# Altium project jetson-nano-baseboard.PrjPcb (part 1 of 2)
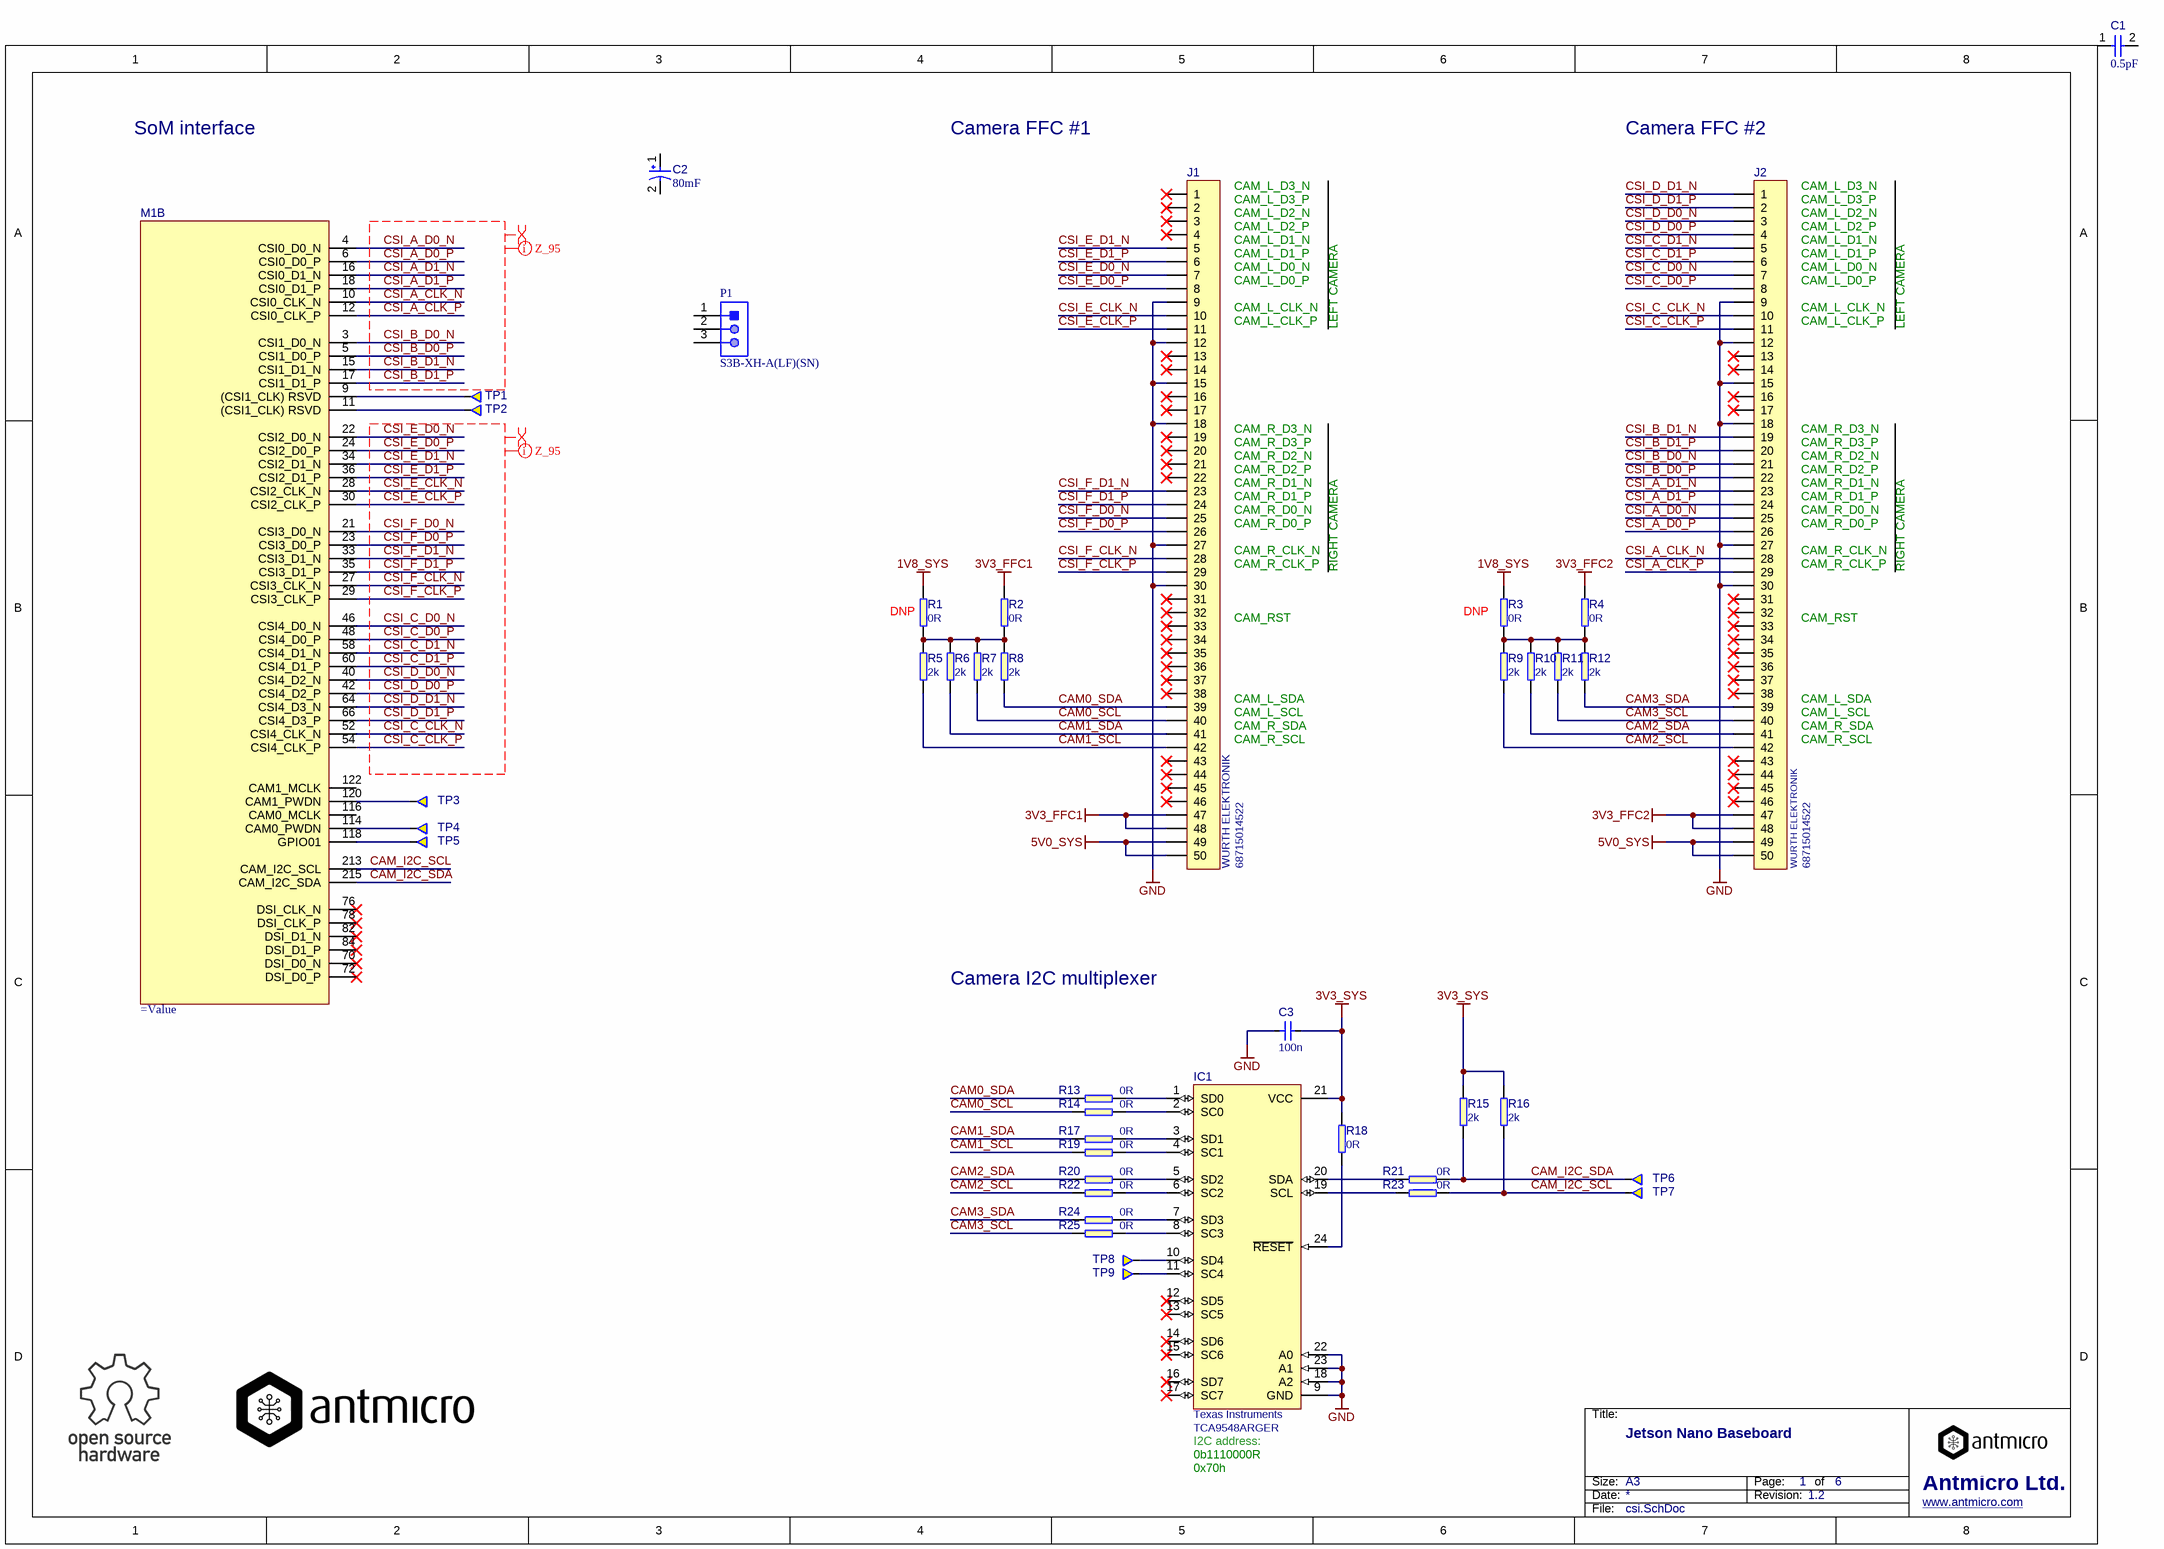
[diagram p0: csi.SchDoc]
AM_Revision: 1.2; AM_Status: Prototype; AM_Title: Jetson Nano Baseboard
6 sheets, 290 parts. Net scope: global (net labels, ports and power ports of the same name join across sheets).
Board file: PCB.PcbDoc
Sheets:
  csi.SchDoc
  display.SchDoc
  ethernet.SchDoc
  SoM.SchDoc
  supply.SchDoc
  usb-debug.SchDoc

## Sheet csi.SchDoc
size A3; DocumentNumber: 1; SheetNumber: 1; SheetTotal: 6; PageSetup: Record=PageOptions|CenterHorizontal=True|CenterVertical=True|PrintScale=0.97|XCorrection=1.00|YCorrection=1.00|PrintKind=1|BorderSize=5000000|LeftOffset=0|BottomOffset=0|Orientation=2|PaperLength=2970|PaperWidth=2100|Scale=100|PaperSource=7|PrintQuality=600|MediaType=1|DitherType=10|PaperKind=A4|PrintScaleMode=1

### Parts
C1  value 0.5pF  [CAPC1005X56X25ML10T15]  (hidden comment: Capacitor 0.5 pF +/- 0.1pF 25 V 0402)
C2  value 80mF  [SEIK-XH414HG-IV01E_V]  (hidden comment: XH414HG-IV01E)
C3  100n  [0402]
IC1  TCA9548ARGER  Manufacturer: Texas Instruments  [VQFN-24]
J1  68715014522  Manufacturer: WURTH ELEKTRONIK  [68715014522]
J2  68715014522  Manufacturer: WURTH ELEKTRONIK  [68715014522]
M1  (no value)  [jetson-nano-connector]  (part B of 7)
P1  S3B-XH-A(LF)(SN)  [JST-S3B-XH-A(LF)(SN)_V]
R1  0R  [0402]
R2  0R  [0402]
R3  0R  [0402]
R4  0R  [0402]
R5  2k  [0402]
R6  2k  [0402]
R7  2k  [0402]
R8  2k  [0402]
R9  2k  [0402]
R10  2k  [0402]
R11  2k  [0402]
R12  2k  [0402]
R13  0R  [0402]
R14  0R  [0402]
R15  2k  [0402]
R16  2k  [0402]
R17  0R  [0402]
R18  0R  [0402]
R19  0R  [0402]
R20  0R  [0402]
R21  0R  [0402]
R22  0R  [0402]
R23  0R  [0402]
R24  0R  [0402]
R25  0R  [0402]
TP1  Testpad  [TP-R-1.5]  (value not drawn)  (no BOM)
TP2  Testpad  [TP-R-1.5]  (value not drawn)  (no BOM)
TP3  Testpad  [TP-R-1.5]  (value not drawn)  (no BOM)
TP4  Testpad  [TP-R-1.5]  (value not drawn)  (no BOM)
TP5  Testpad  [TP-R-1.5]  (value not drawn)  (no BOM)
TP6  Testpad  [TP-R-1.5]  (value not drawn)  (no BOM)
TP7  Testpad  [TP-R-1.5]  (value not drawn)  (no BOM)
TP8  Testpad  [TP-R-1.5]  (value not drawn)  (no BOM)
TP9  Testpad  [TP-R-1.5]  (value not drawn)  (no BOM)

### Nets
1V8_SYS: R1.2 R3.2
3V3_FFC1: J1.47 J1.48 R2.2
3V3_FFC2: J2.47 J2.48 R4.2
3V3_SYS: C3.2 IC1.21(VCC) R15.1 R16.1 R18.2
5V0_SYS: J1.49 J1.50 J2.49 J2.50
GND: C3.1 IC1.9(GND) IC1.18(A2) IC1.22(A0) IC1.23(A1) J1.9 J1.12 J1.15 J1.18 J1.27 J1.30 J2.9 J2.12 J2.15 J2.18 J2.27 J2.30
CAM0_SCL: J1.40 R7.2 R14.1
CAM0_SDA: J1.39 R8.2 R13.1
CAM1_SCL: J1.42 R5.2 R19.1
CAM1_SDA: J1.41 R6.2 R17.1
CAM2_SCL: J2.42 R9.2 R22.1
CAM2_SDA: J2.41 R10.2 R20.1
CAM3_SCL: J2.40 R11.2 R25.1
CAM3_SDA: J2.39 R12.2 R24.1
CAM_I2C_SCL: M1.213(CAM_I2C_SCL) R16.2 R23.2 TP7.1
CAM_I2C_SDA: M1.215(CAM_I2C_SDA) R15.2 R21.2 TP6.1
CSI_A_CLK_N: J2.28 M1.10(CSI0_CLK_N)
CSI_A_CLK_P: J2.29 M1.12(CSI0_CLK_P)
CSI_A_D0_N: J2.25 M1.4(CSI0_D0_N)
CSI_A_D0_P: J2.26 M1.6(CSI0_D0_P)
CSI_A_D1_N: J2.23 M1.16(CSI0_D1_N)
CSI_A_D1_P: J2.24 M1.18(CSI0_D1_P)
CSI_B_D0_N: J2.21 M1.3(CSI1_D0_N)
CSI_B_D0_P: J2.22 M1.5(CSI1_D0_P)
CSI_B_D1_N: J2.19 M1.15(CSI1_D1_N)
CSI_B_D1_P: J2.20 M1.17(CSI1_D1_P)
CSI_C_CLK_N: J2.10 M1.52(CSI4_CLK_N)
CSI_C_CLK_P: J2.11 M1.54(CSI4_CLK_P)
CSI_C_D0_N: J2.7 M1.46(CSI4_D0_N)
CSI_C_D0_P: J2.8 M1.48(CSI4_D0_P)
CSI_C_D1_N: J2.5 M1.58(CSI4_D1_N)
CSI_C_D1_P: J2.6 M1.60(CSI4_D1_P)
CSI_D_D0_N: J2.3 M1.40(CSI4_D2_N)
CSI_D_D0_P: J2.4 M1.42(CSI4_D2_P)
CSI_D_D1_N: J2.1 M1.64(CSI4_D3_N)
CSI_D_D1_P: J2.2 M1.66(CSI4_D3_P)
CSI_E_CLK_N: J1.10 M1.28(CSI2_CLK_N)
CSI_E_CLK_P: J1.11 M1.30(CSI2_CLK_P)
CSI_E_D0_N: J1.7 M1.22(CSI2_D0_N)
CSI_E_D0_P: J1.8 M1.24(CSI2_D0_P)
CSI_E_D1_N: J1.5 M1.34(CSI2_D1_N)
CSI_E_D1_P: J1.6 M1.36(CSI2_D1_P)
CSI_F_CLK_N: J1.28 M1.27(CSI3_CLK_N)
CSI_F_CLK_P: J1.29 M1.29(CSI3_CLK_P)
CSI_F_D0_N: J1.25 M1.21(CSI3_D0_N)
CSI_F_D0_P: J1.26 M1.23(CSI3_D0_P)
CSI_F_D1_N: J1.23 M1.33(CSI3_D1_N)
CSI_F_D1_P: J1.24 M1.35(CSI3_D1_P)
NetIC1_1: IC1.1(SD0) R13.2
NetIC1_2: IC1.2(SC0) R14.2
NetIC1_3: IC1.3(SD1) R17.2
NetIC1_4: IC1.4(SC1) R19.2
NetIC1_5: IC1.5(SD2) R20.2
NetIC1_6: IC1.6(SC2) R22.2
NetIC1_7: IC1.7(SD3) R24.2
NetIC1_8: IC1.8(SC3) R25.2
NetIC1_10: IC1.10(SD4) TP8.1
NetIC1_11: IC1.11(SC4) TP9.1
NetIC1_19: IC1.19(SCL) R23.1
NetIC1_20: IC1.20(SDA) R21.1
NetIC1_24: IC1.24(~{RESET}) R18.1
NetM1_9: M1.9((CSI1_CLK)_RSVD) TP1.1
NetM1_11: M1.11((CSI1_CLK)_RSVD) TP2.1
NetM1_114: M1.114(CAM0_PWDN) TP4.1
NetM1_118: M1.118(GPIO01) TP5.1
NetM1_120: M1.120(CAM1_PWDN) TP3.1
NetR1_1: R1.1 R2.1 R5.1 R6.1 R7.1 R8.1
NetR3_1: R3.1 R4.1 R9.1 R10.1 R11.1 R12.1

Not connected (* = marked no-connect by the designer): C1 1 2; C2 1 2; IC1 12(SD5)* 13(SC5)* 14(SD6)* 15(SC6)* 16(SD7)* 17(SC7)*; J1 1* 2* 3* 4* 13* 14* 16* 17* 19* 20* 21* 22* 31* 32* 33* 34* 35* 36* 37* 38* 43* 44* 45* 46*; J2 13* 14* 16* 17* 31* 32* 33* 34* 35* 36* 37* 38* 43* 44* 45* 46*; M1 70(DSI_D0_N)* 72(DSI_D0_P)* 76(DSI_CLK_N)* 78(DSI_CLK_P)* 82(DSI_D1_N)* 84(DSI_D1_P)* 116(CAM0_MCLK) 122(CAM1_MCLK); P1 1 2 3

### Layout directives
differential pair: CSI_A_CLK_N, CSI_A_CLK_P, CSI_A_D0_N, CSI_A_D0_P, CSI_A_D1_N, CSI_A_D1_P, CSI_B_D0_N, CSI_B_D0_P, CSI_B_D1_N, CSI_B_D1_P, CSI_C_CLK_N, CSI_C_CLK_P, CSI_C_D0_N, CSI_C_D0_P, CSI_C_D1_N, CSI_C_D1_P, CSI_D_D0_N, CSI_D_D0_P, CSI_D_D1_N, CSI_D_D1_P, CSI_E_CLK_N, CSI_E_CLK_P, CSI_E_D0_N, CSI_E_D0_P, CSI_E_D1_N, CSI_E_D1_P, CSI_F_CLK_N, CSI_F_CLK_P, CSI_F_D0_N, CSI_F_D0_P, CSI_F_D1_N, CSI_F_D1_P
net class Z_95: CSI_A_CLK_N, CSI_A_CLK_P, CSI_A_D0_N, CSI_A_D0_P, CSI_A_D1_N, CSI_A_D1_P, CSI_B_D0_N, CSI_B_D0_P, CSI_B_D1_N, CSI_B_D1_P, CSI_C_CLK_N, CSI_C_CLK_P, CSI_C_D0_N, CSI_C_D0_P, CSI_C_D1_N, CSI_C_D1_P, CSI_D_D0_N, CSI_D_D0_P, CSI_D_D1_N, CSI_D_D1_P, CSI_E_CLK_N, CSI_E_CLK_P, CSI_E_D0_N, CSI_E_D0_P, CSI_E_D1_N, CSI_E_D1_P, CSI_F_CLK_N, CSI_F_CLK_P, CSI_F_D0_N, CSI_F_D0_P, CSI_F_D1_N, CSI_F_D1_P

### Notes on the sheet
- SoM interface
- Camera FFC #1
- Camera FFC #2
- (near J1) CAM_L_D3_N
- (near J1) CAM_L_D3_P
- (near J1) CAM_L_D2_N
- (near J2) CAM_L_D3_N
- (near J2) CAM_L_D3_P
- (near J2) CAM_L_D2_N
- (near J1) CAM_L_D2_P
- (near J1) CAM_L_D1_N
- (near J1) CAM_L_D1_P
- (near J1) CAM_L_D0_N
- (near J1) CAM_L_D0_P
- (near J2) CAM_L_D2_P
- (near J2) CAM_L_D1_N
- (near J2) CAM_L_D1_P
- (near J2) CAM_L_D0_N
- (near J2) CAM_L_D0_P
- (near J1) CAM_L_CLK_N
- (near J1) CAM_L_CLK_P
- LEFT CAMERA
- (near J2) CAM_L_CLK_N
- (near J2) CAM_L_CLK_P
- (near J1) CAM_R_D3_N
- (near J1) CAM_R_D3_P
- (near J1) CAM_R_D2_N
- (near J1) CAM_R_D2_P
- (near J1) CAM_R_D1_N
- (near J2) CAM_R_D3_N
- (near J2) CAM_R_D3_P
- (near J2) CAM_R_D2_N
- (near J2) CAM_R_D2_P
- (near J2) CAM_R_D1_N
- (near J1) CAM_R_D1_P
- (near J1) CAM_R_D0_N
- (near J1) CAM_R_D0_P
- (near J1) CAM_R_CLK_N
- (near J2) CAM_R_D1_P
- (near J2) CAM_R_D0_N
- (near J2) CAM_R_D0_P
- (near J2) CAM_R_CLK_N
- (near R1) DNP
- (near J1) CAM_RST
- (near J1) CAM_R_CLK_P
- RIGHT CAMERA
- (near R3) DNP
- (near J2) CAM_RST
- (near J2) CAM_R_CLK_P
- (near J1) CAM_L_SDA
- (near J1) CAM_L_SCL
- (near J1) CAM_R_SDA
- (near J1) CAM_R_SCL
- (near J2) CAM_L_SDA
- (near J2) CAM_L_SCL
- (near J2) CAM_R_SDA
- (near J2) CAM_R_SCL
- Camera I2C multiplexer
- 0x70h
- 0b1110000R
- (near IC1) I2C address:
- Title:
- Size:
- Date:
- A3
- Revision:
- Page:
- of
- Antmicro Ltd.
- File:
- www.antmicro.com

### Library data of the parts
C1 = CMP-001-00002-4: Chip Capacitor, 0.5 pF, +/- 0.1pF, 25 V, 0402 (1005 Metric); Capacitor Type: Ceramic; Tolerance: 20%; Voltage Rating: 25V; Case/Package: 0402; Max Operating Temperature: 125°C; RoHS Compliant: True; Min Operating Temperature: -55°C; Mounting Technology: SM; Pins: 2
C2 = CMP-001-00052-5: Electric Double Layer Capacitor, 80 mF, 3.3 V, -20 to 60 degC, RoHS; Manufacturer: Seiko Instruments; Voltage Rating: 3.3V; Capacitor Type: Electrolytic; Max Operating Temperature: 60°C; Package Reference: XH414HG-IV01E; RoHS Compliant: True; Datasheet Version: 39814; Mounting Technology: SM; Datasheet URL: http://media.digikey.com/pdf/Data%20Sheets/Seiko%20Instruments%20PDFs/XH414HG,%20XH409HG.pdf; Pins: 2; Manufacturer URL: http://www.sii.co.jp/en/; Package Description: 2-Pin Surface Mount Device, Diameter 4.8 mm; Case/Package: XH414HG-IV01E; Min Operating Temperature: -20°C
C3 = C_100n_0402: MLCC SMT Capacitor 100n 0402; Manufacturer: TDK; PartSymbol: C1005X5R0J104K050BA; Value: 100n; PartNumber: C_100n_0402
IC1 = TCA9548A: TCA9548ARGER  I2C SWITCH W/ RESET, 8-CH, VQFN-24; Value: TCA9548ARGER; PartNumber: TCA9548ARGER; PartSymbol: TCA9548ARGER
J1 J2 = 1X50: 0.50mm SMT ZIF Horizontal Bottom Contact WR-FPC; PartNumber: WE-687-150-145-22; Pinsnumber: 50; Value: 68715014522; PartSymbol: 68715014522
M1 = Jetson-Nano-new-release: PartNumber: jetson-nano-new-release
P1 = CMP-002-00033-1: Male Header, Pitch 2.5 mm, 1 x 3 Position, Height 6.1 mm, Tail Length 3.4 mm, -25 to 85 degC, RoHS, Bulk; Manufacturer: JST; Case/Package: S3B-XH-A(LF)(SN); Package Reference: S3B-XH-A(LF)(SN); Package Description: Male Header, Pitch 2.5 mm, 1 x 3 Position, Height 6.1 mm, Tail Length 3.4 mm; Connector Type: Header; Manufacturer URL: http://www.jst.com/home2.html; Datasheet Version: May-16; Max Operating Temperature: 85°C; Mounting Technology: TH; Gender: Male; Min Operating Temperature: -25°C; Datasheet URL: http://www.jst-mfg.com/product/pdf/eng/eXH.pdf; RoHS Compliant: Unknown
R1-R4 R13 R14 R17-R25 = R_0R_0402: RES, 0R, 0402; Manufacturer: Panasonic; PartSymbol: ERJ2GE0R00X; Value: 0R; PartNumber: R_0R_0402
R5-R12 R15 R16 = R_2k_0402: RES, 2k, 0402; Manufacturer: VISHAY; PartSymbol: CRCW04022K00FKED; PartNumber: R_2k_0402; Value: 2k
TP1-TP9 = Testpad: Testpad, round, 1.5mm; PartNumber: TP-R-1.5

## Sheet display.SchDoc
size A3; DocumentNumber: 2; SheetNumber: 2; SheetTotal: 6; PageSetup: Record=PageOptions|CenterHorizontal=True|CenterVertical=True|PrintScale=0.97|XCorrection=1.00|YCorrection=1.00|PrintKind=1|BorderSize=5000000|LeftOffset=0|BottomOffset=0|Orientation=2|PaperLength=2970|PaperWidth=2100|Scale=100|PaperSource=7|PrintQuality=600|MediaType=1|DitherType=10|PaperKind=A4|PrintScaleMode=1
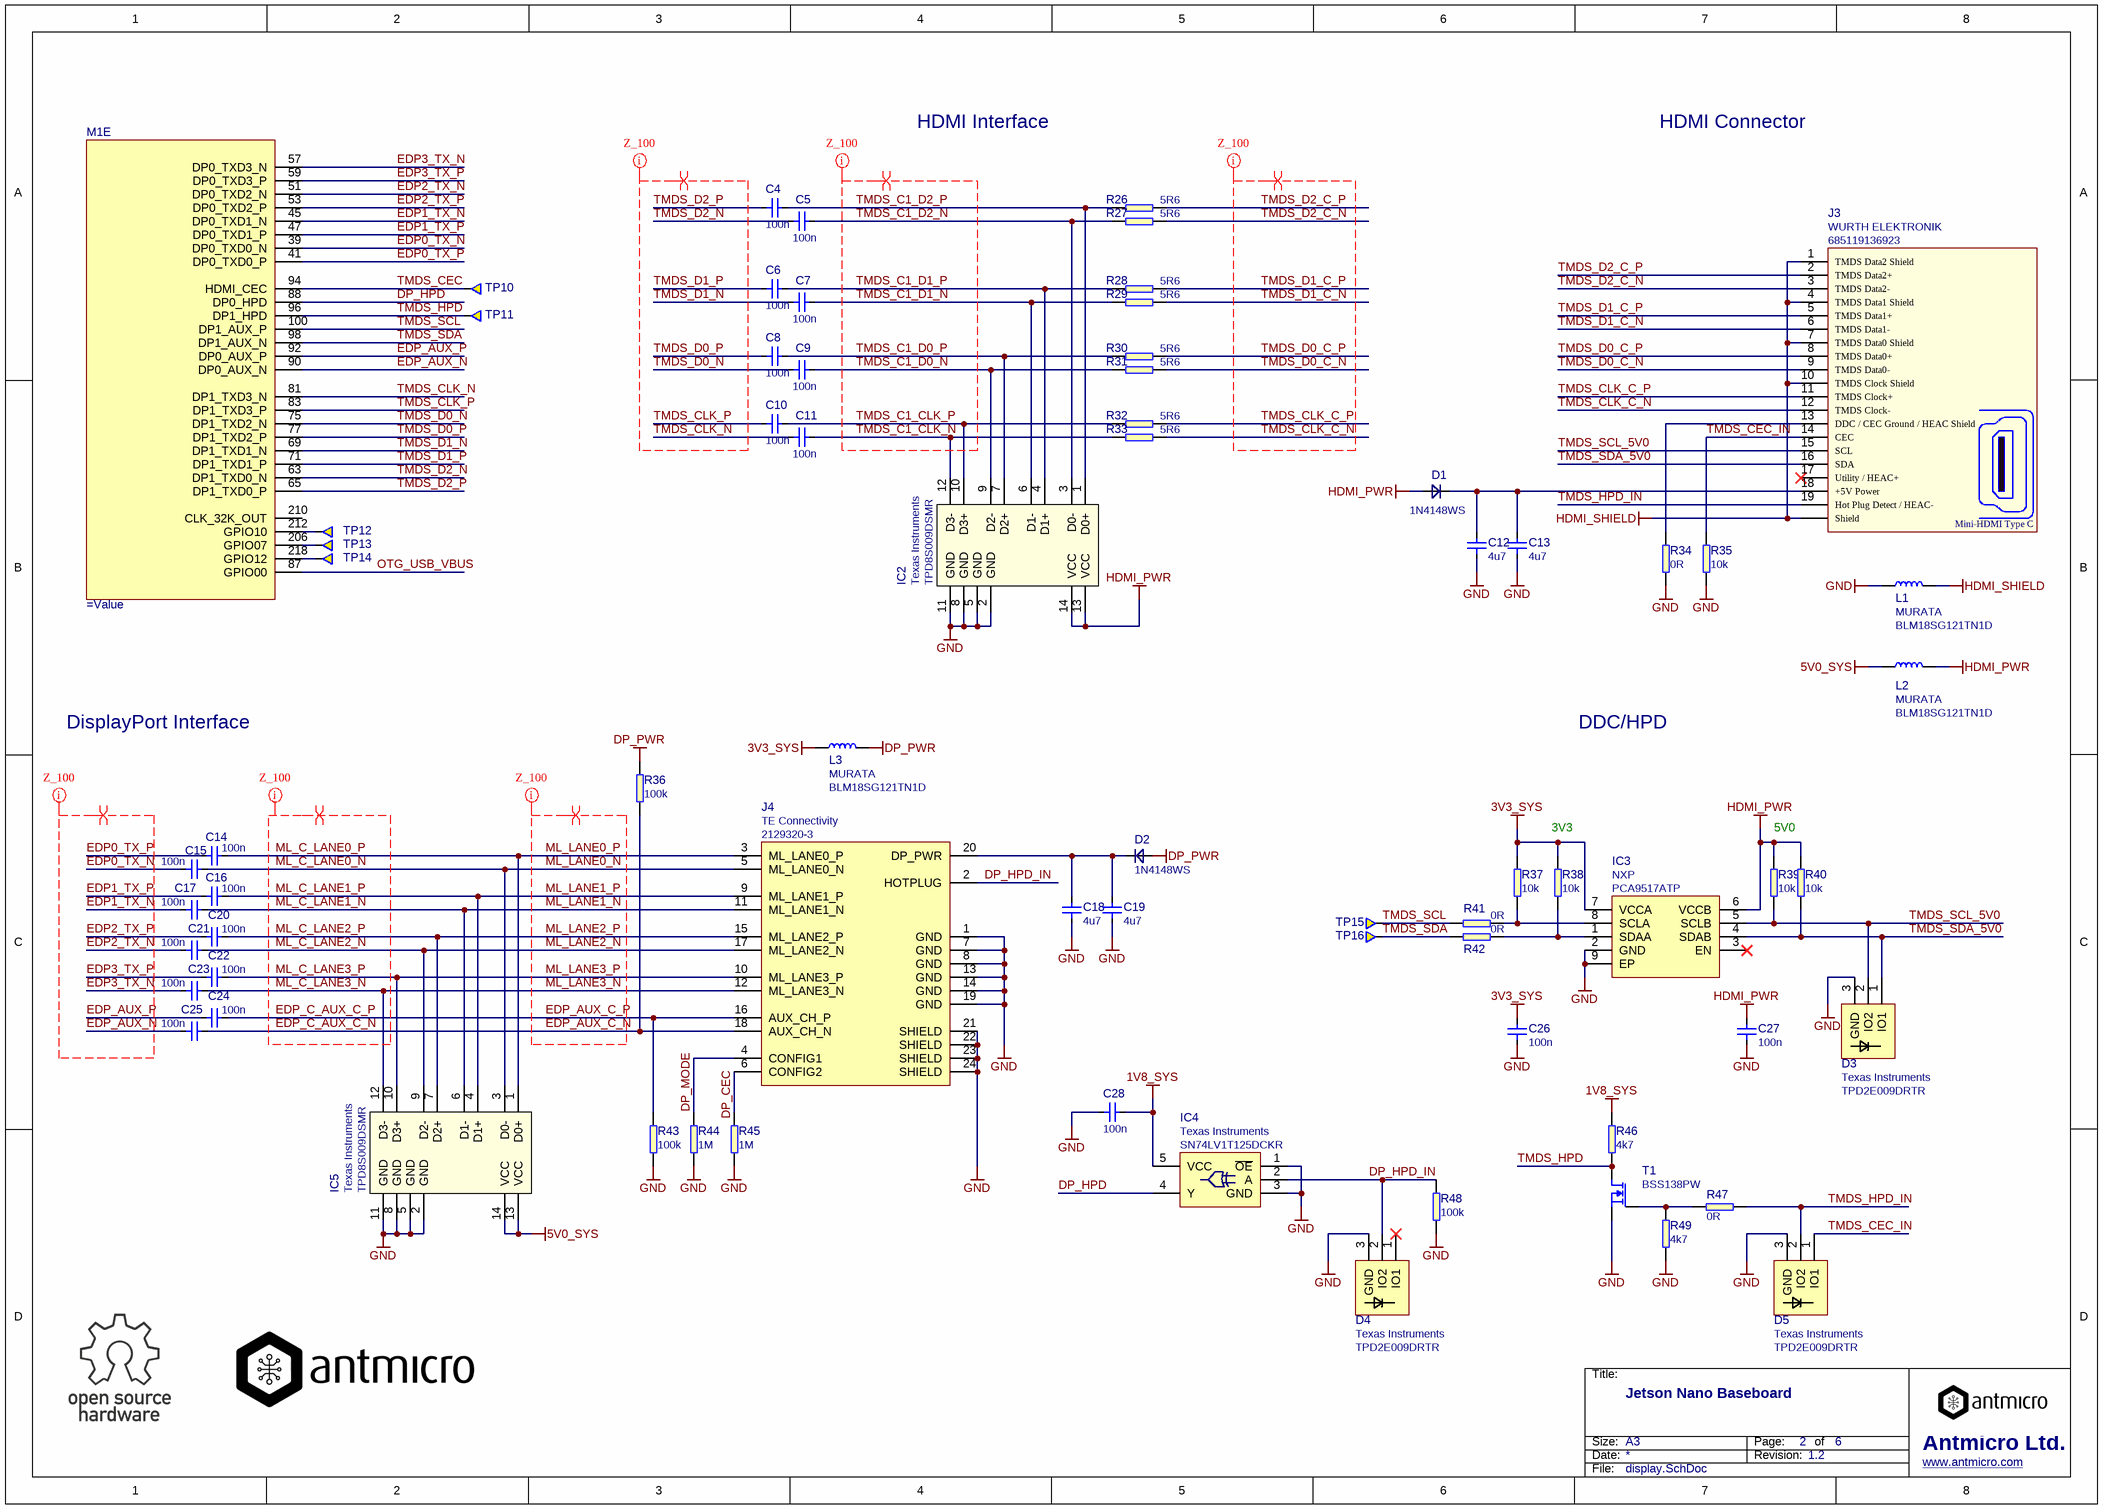
[diagram p1: display.SchDoc]

### Parts
C4  100n  [0402]
C5  100n  [0402]
C6  100n  [0402]
C7  100n  [0402]
C8  100n  [0402]
C9  100n  [0402]
C10  100n  [0402]
C11  100n  [0402]
C12  4u7  [0402]
C13  4u7  [0402]
C14  100n  [0402]
C15  100n  [0402]
C16  100n  [0402]
C17  100n  [0402]
C18  4u7  [0402]
C19  4u7  [0402]
C20  100n  [0402]
C21  100n  [0402]
C22  100n  [0402]
C23  100n  [0402]
C24  100n  [0402]
C25  100n  [0402]
C26  100n  [0603]
C27  100n  [0603]
C28  100n  [0603]
D1  1N4148WS  [SOD-323]
D2  1N4148WS  [SOD-323]
D3  TPD2E009DRTR  Manufacturer: Texas Instruments  [SOT-3]
D4  TPD2E009DRTR  Manufacturer: Texas Instruments  [SOT-3]
D5  TPD2E009DRTR  Manufacturer: Texas Instruments  [SOT-3]
IC2  Manufacturer: Texas Instruments  PartSymbol: TPD8S009DSMR  [SON-15]  (hidden comment: TPD8S009)
IC3  PCA9517ATP  Manufacturer: NXP  [PCA9517ATP]
IC4  SN74LV1T125DCKR  Manufacturer: Texas Instruments  [SC70-5]
IC5  Manufacturer: Texas Instruments  PartSymbol: TPD8S009DSMR  [SON-15]  (hidden comment: TPD8S009)
J3  685119136923  Manufacturer: WURTH ELEKTRONIK  [WE_685119136923]
J4  2129320-3  Manufacturer: TE Connectivity  [2129320-3]
L1  BLM18SG121TN1D  Manufacturer: MURATA  [0603]
L2  BLM18SG121TN1D  Manufacturer: MURATA  [0603]
L3  BLM18SG121TN1D  Manufacturer: MURATA  [0603]
M1  (no value)  [jetson-nano-connector]  (part E of 7)
R26  5R6  [0402]
R27  5R6  [0402]
R28  5R6  [0402]
R29  5R6  [0402]
R30  5R6  [0402]
R31  5R6  [0402]
R32  5R6  [0402]
R33  5R6  [0402]
R34  0R  [0402]
R35  10k  [0402]
R36  100k  [0603]
R37  10k  [0603]
R38  10k  [0603]
R39  10k  [0603]
R40  10k  [0603]
R41  0R  [0402]
R42  0R  [0402]
R43  100k  [0603]
R44  1M  [0603]
R45  1M  [0603]
R46  4k7  [0603]
R47  0R  [0402]
R48  100k  [0603]
R49  4k7  [0603]
T1  BSS138PW  [SC70-3]
TP10  Testpad  [TP-R-1.5]  (value not drawn)  (no BOM)
TP11  Testpad  [TP-R-1.5]  (value not drawn)  (no BOM)
TP12  Testpad  [TP-R-1.5]  (value not drawn)  (no BOM)
TP13  Testpad  [TP-R-1.5]  (value not drawn)  (no BOM)
TP14  Testpad  [TP-R-1.5]  (value not drawn)  (no BOM)
TP15  Testpad  [TP-R-1.5]  (value not drawn)  (no BOM)
TP16  Testpad  [TP-R-1.5]  (value not drawn)  (no BOM)

### Nets
1V8_SYS: C28.2 IC4.5(VCC) R46.2
3V3_SYS: C26.2 IC3.7(VCCA) L3.1 R37.2 R38.2
5V0_SYS: IC5.13(VCC) IC5.14(VCC) L2.1
DP_PWR: D2.A L3.2 R36.1
GND: C12.1 C13.1 C18.1 C19.1 C26.1 C27.1 C28.1 D3.3(GND) D4.3(GND) D5.3(GND) IC2.2(GND) IC2.5(GND) IC2.8(GND) IC2.11(GND) IC3.2(GND) IC3.9(EP) IC4.1(~{OE}) IC4.3(GND) IC5.2(GND) IC5.5(GND) IC5.8(GND) IC5.11(GND) J4.1(GND) J4.7(GND) J4.8(GND) J4.13(GND) J4.14(GND) J4.19(GND) J4.21(SHIELD) J4.22(SHIELD) J4.23(SHIELD) J4.24(SHIELD) L1.1 R34.1 R35.1 R43.1 R44.1 R45.1 R48.2 R49.1 T1.2(S)
HDMI_PWR: C27.2 D1.A IC2.13(VCC) IC2.14(VCC) IC3.6(VCCB) L2.2 R39.2 R40.2
HDMI_SHIELD: J3.1(TMDS_Data2_Shield) J3.4(TMDS_Data1_Shield) J3.7(TMDS_Data0_Shield) J3.10(TMDS_Clock_Shield) J3.Shell(Shield) L1.2
DP_HPD: IC4.4(Y) M1.88(DP0_HPD)
DP_HPD_IN: D4.2(IO2) IC4.2(A) J4.2(HOTPLUG) R48.1
DP_MODE: J4.4(CONFIG1) R44.2
EDP0_TX_N: C15.1 M1.39(DP0_TXD0_N)
EDP0_TX_P: C14.1 M1.41(DP0_TXD0_P)
EDP1_TX_N: C17.1 M1.45(DP0_TXD1_N)
EDP1_TX_P: C16.1 M1.47(DP0_TXD1_P)
EDP2_TX_N: C21.1 M1.51(DP0_TXD2_N)
EDP2_TX_P: C20.1 M1.53(DP0_TXD2_P)
EDP3_TX_N: C22.1 M1.57(DP0_TXD3_N)
EDP3_TX_P: C23.1 M1.59(DP0_TXD3_P)
EDP_AUX_C_N: C25.2 J4.18(AUX_CH_N) R36.2  [also labelled EDP_C_AUX_C_N]
EDP_AUX_C_P: C24.2 J4.16(AUX_CH_P) R43.2  [also labelled EDP_C_AUX_C_P]
EDP_AUX_N: C25.1 M1.90(DP0_AUX_N)
EDP_AUX_P: C24.1 M1.92(DP0_AUX_P)
ML_C_LANE0_N: C15.2 IC5.3(D0-) J4.5(ML_LANE0_N)  [also labelled ML_LANE0_N]
ML_C_LANE0_P: C14.2 IC5.1(D0+) J4.3(ML_LANE0_P)  [also labelled ML_LANE0_P]
ML_C_LANE1_N: C17.2 IC5.6(D1-) J4.11(ML_LANE1_N)  [also labelled ML_LANE1_N]
ML_C_LANE1_P: C16.2 IC5.4(D1+) J4.9(ML_LANE1_P)  [also labelled ML_LANE1_P]
ML_C_LANE2_N: C21.2 IC5.9(D2-) J4.17(ML_LANE2_N)  [also labelled ML_LANE2_N]
ML_C_LANE2_P: C20.2 IC5.7(D2+) J4.15(ML_LANE2_P)  [also labelled ML_LANE2_P]
ML_C_LANE3_N: C22.2 IC5.12(D3-) J4.12(ML_LANE3_N)  [also labelled ML_LANE3_N]
ML_C_LANE3_P: C23.2 IC5.10(D3+) J4.10(ML_LANE3_P)  [also labelled ML_LANE3_P]
OTG_USB_VBUS: M1.87(GPIO00)
TMDS_C1_CLK_N: C11.2 IC2.12(D3-) R33.1
TMDS_C1_CLK_P: C10.2 IC2.10(D3+) R32.1
TMDS_C1_D0_N: C9.2 IC2.9(D2-) R31.1
TMDS_C1_D0_P: C8.2 IC2.7(D2+) R30.1
TMDS_C1_D1_N: C7.2 IC2.6(D1-) R29.1
TMDS_C1_D1_P: C6.2 IC2.4(D1+) R28.1
TMDS_C1_D2_N: C5.2 IC2.3(D0-) R27.1
TMDS_C1_D2_P: C4.2 IC2.1(D0+) R26.1
TMDS_CEC: M1.94(HDMI_CEC) TP10.1
TMDS_CEC_IN: D5.1(IO1) J3.14(CEC) R35.2
TMDS_CLK_C_N: J3.12(TMDS_Clock-) R33.2
TMDS_CLK_C_P: J3.11(TMDS_Clock+) R32.2
TMDS_CLK_N: C11.1 M1.81(DP1_TXD3_N)
TMDS_CLK_P: C10.1 M1.83(DP1_TXD3_P)
TMDS_D0_C_N: J3.9(TMDS_Data0-) R31.2
TMDS_D0_C_P: J3.8(TMDS_Data0+) R30.2
TMDS_D0_N: C9.1 M1.75(DP1_TXD2_N)
TMDS_D0_P: C8.1 M1.77(DP1_TXD2_P)
TMDS_D1_C_N: J3.6(TMDS_Data1-) R29.2
TMDS_D1_C_P: J3.5(TMDS_Data1+) R28.2
TMDS_D1_N: C7.1 M1.69(DP1_TXD1_N)
TMDS_D1_P: C6.1 M1.71(DP1_TXD1_P)
TMDS_D2_C_N: J3.3(TMDS_Data2-) R27.2
TMDS_D2_C_P: J3.2(TMDS_Data2+) R26.2
TMDS_D2_N: C5.1 M1.63(DP1_TXD0_N)
TMDS_D2_P: C4.1 M1.65(DP1_TXD0_P)
TMDS_HPD: M1.96(DP1_HPD) R46.1 T1.3(D) TP11.1
TMDS_HPD_IN: D5.2(IO2) J3.19(Hot_Plug_Detect_/_HEAC-) R47.1
TMDS_SCL: M1.100(DP1_AUX_P) R41.2 TP15.1
TMDS_SCL_5V0: D3.2(IO2) IC3.5(SCLB) J3.15(SCL) R39.1
TMDS_SDA: M1.98(DP1_AUX_N) R42.2 TP16.1
TMDS_SDA_5V0: D3.1(IO1) IC3.4(SDAB) J3.16(SDA) R40.1
NetC12_2: C12.2 C13.2 D1.C J3.18(+5V_Power)
NetC18_2: C18.2 C19.2 D2.C J4.20(DP_PWR)
NetIC3_1: IC3.1(SDAA) R38.1 R42.1
NetIC3_8: IC3.8(SCLA) R37.1 R41.1
NetJ3_13: J3.13(DDC_/_CEC_Ground_/_HEAC_Shield) R34.2
NetJ4_6: J4.6(CONFIG2) R45.2
NetM1_206: M1.206(GPIO07) TP13.1
NetM1_212: M1.212(GPIO10) TP12.1
NetM1_218: M1.218(GPIO12) TP14.1
NetR47_2: R47.2 R49.2 T1.1(G)

Not connected (* = marked no-connect by the designer): D4 1(IO1)*; IC3 3(EN)*; J3 17(Utility_/_HEAC+)*; M1 210(CLK_32K_OUT)

### Layout directives
differential pair: EDP0_TX_N, EDP0_TX_P, EDP1_TX_N, EDP1_TX_P, EDP2_TX_N, EDP2_TX_P, EDP3_TX_N, EDP3_TX_P, EDP_AUX_C_N, EDP_AUX_C_P, EDP_AUX_N, EDP_AUX_P, EDP_C_AUX_C_N, EDP_C_AUX_C_P, ML_C_LANE0_N, ML_C_LANE0_P, ML_C_LANE1_N, ML_C_LANE1_P, ML_C_LANE2_N, ML_C_LANE2_P, ML_C_LANE3_N, ML_C_LANE3_P, ML_LANE0_N, ML_LANE0_P, ML_LANE1_N, ML_LANE1_P, ML_LANE2_N, ML_LANE2_P, ML_LANE3_N, ML_LANE3_P, TMDS_C1_CLK_N, TMDS_C1_CLK_P, TMDS_C1_D0_N, TMDS_C1_D0_P, TMDS_C1_D1_N, TMDS_C1_D1_P, TMDS_C1_D2_N, TMDS_C1_D2_P, TMDS_CLK_C_N, TMDS_CLK_C_P, TMDS_CLK_N, TMDS_CLK_P, TMDS_D0_C_N, TMDS_D0_C_P, TMDS_D0_N, TMDS_D0_P, TMDS_D1_C_N, TMDS_D1_C_P, TMDS_D1_N, TMDS_D1_P, TMDS_D2_C_N, TMDS_D2_C_P, TMDS_D2_N, TMDS_D2_P
net class Z_100: EDP0_TX_N, EDP0_TX_P, EDP1_TX_N, EDP1_TX_P, EDP2_TX_N, EDP2_TX_P, EDP3_TX_N, EDP3_TX_P, EDP_AUX_C_N, EDP_AUX_C_P, EDP_AUX_N, EDP_AUX_P, EDP_C_AUX_C_N, EDP_C_AUX_C_P, ML_C_LANE0_N, ML_C_LANE0_P, ML_C_LANE1_N, ML_C_LANE1_P, ML_C_LANE2_N, ML_C_LANE2_P, ML_C_LANE3_N, ML_C_LANE3_P, ML_LANE0_N, ML_LANE0_P, ML_LANE1_N, ML_LANE1_P, ML_LANE2_N, ML_LANE2_P, ML_LANE3_N, ML_LANE3_P, TMDS_C1_CLK_N, TMDS_C1_CLK_P, TMDS_C1_D0_N, TMDS_C1_D0_P, TMDS_C1_D1_N, TMDS_C1_D1_P, TMDS_C1_D2_N, TMDS_C1_D2_P, TMDS_CLK_C_N, TMDS_CLK_C_P, TMDS_CLK_N, TMDS_CLK_P, TMDS_D0_C_N, TMDS_D0_C_P, TMDS_D0_N, TMDS_D0_P, TMDS_D1_C_N, TMDS_D1_C_P, TMDS_D1_N, TMDS_D1_P, TMDS_D2_C_N, TMDS_D2_C_P, TMDS_D2_N, TMDS_D2_P

### Notes on the sheet
- HDMI Interface
- HDMI Connector
- 1V8
- DisplayPort Interface
- DDC/HPD
- 3V3
- 5V0
- Labels drawn without touching a wire or pin: DP_CEC
- Title:
- Size:
- Date:
- A3
- Revision:
- Page:
- of
- Antmicro Ltd.
- File:
- www.antmicro.com
- (in symbol WE_685119136923) Mini-HDMI Type C

### Library data of the parts
C4-C11 C14-C17 C20-C25 = C_100n_0402: as C3 on sheet csi; Value: 100n; PartNumber: C_100n_0402
C12 C13 C18 C19 = C_4u7_0402: MLCC SMT Capacitor 4.7uF 0402; Manufacturer: MURATA; PartSymbol: GRM155R60G475ME; PartNumber: C_4u7_0402; Value: 4u7
C26-C28 = C_100n_0603: MLCC SMT Capacitor 100nF 0603; Manufacturer: AVX; PartSymbol: 0603YC104KAZ2A; Value: 100n; PartNumber: C_100n_0603
D1 D2 = diode: Diode small signal; Manufacturer: ON SEMICONDUCTOR; Value: 1N4148WS; PartNumber: 1N4148WS; PartSymbol: 1N4148WS
D3-D5 = TPD2E009: ESD Suppressors 2-CH; Value: TPD2E009DRTR; PartNumber: TPD2E009DRTR; PartSymbol: TPD2E009DRTR
IC2 IC5 = TPD8S009: 8-Channel ESD Protection for DisplayPort and HDMI; Value: TPD8S009; PartNumber: TPD8S009
IC3 = PCA9517ATP: I2C BUS REPEATER W/ LEVEL TRANS, HWSON-8; Value: PCA9517ATP; PartNumber: PCA9517ATP; PartSymbol: PCA9517ATP
IC4 = SN74LV1T125: Buffer, 74LV1T125, 1.6 V to 5.5 V, SOT-23-5; PartNumber: SN74LV1T125DCKR; Value: SN74LV1T125DCKR; PartSymbol: SN74LV1T125DCKR
J3 = WE_685119136923: CONN HDMI FEMALE R/A 19POS 2.6MM; PartNumber: WE_685119136923; Value: 685119136923; PartSymbol: WE_685119136923
J4 = miniDP: Mini Displayport Reverse Offset; PartNumber: 2129320-3; Value: 2129320-3; PartSymbol: 2129320-3
L1-L3 = BLM18SG121TN1D: FERRITE BEAD, 0.025OHM, 3A, 0603; Value: BLM18SG121TN1D; PartNumber: BLM18SG121TN1D; PartSymbol: BLM18SG121TN1D
M1 = jetson-nano-new-release: PartNumber: jetson-nano-new-release
R26-R33 = R_5R6_0402: RES, 5R6, 0402; Manufacturer: Panasonic; PartSymbol: ERJ2GEJ5R6X; PartNumber: R_5R6_0402; Value: 5R6
R34 R41 R42 R47 = R_0R_0402: as R1 on sheet csi; PartNumber: R_0R_0402; Value: 0R
R35 = R_10k_0402: RES, 10k, 0402; Manufacturer: MULTICOMP; PartSymbol: MCMR04X1002FTL; Value: 10k; PartNumber: R_10k_0402
R36 R43 R48 = R_100k_0603: RES, 100k, 0603; Manufacturer: BOURNS; PartSymbol: CR0603-FX-1003HLF; Value: 100k; PartNumber: R_100k_0603
R37-R40 = R_10k_0603: RES, 10k, 0603; Manufacturer: BOURNS; PartSymbol: CR0603-JW-103ELF; Value: 10k; PartNumber: R_10k_0603
R44 R45 = R_1M_0603: RES, 1M, 0603; Manufacturer: BOURNS; PartSymbol: CR0603-JW-105GLF; Value: 1M; PartNumber: R_1M_0603
R46 R49 = R_4k7_0603: RES, 4k7, 0603; Manufacturer: BOURNS; PartSymbol: CR0603-FX-4701ELF; Value: 4k7; PartNumber: R_4k7_0603
T1 = NMOS: MOSFET, N CH, 60V, 0.2A; Manufacturer: NXP; Value: BSS138PW; PartNumber: BSS138PW; PartSymbol: BSS138PW
TP10-TP16 = Testpad: Testpad, round, 1.5mm; PartNumber: TP-R-1.5

## Sheet ethernet.SchDoc
size A3; DocumentNumber: 3; SheetNumber: 3; SheetTotal: 6; PageSetup: Record=PageOptions|CenterHorizontal=True|CenterVertical=True|PrintScale=0.97|XCorrection=1.00|YCorrection=1.00|PrintKind=1|BorderSize=5000000|LeftOffset=0|BottomOffset=0|Orientation=2|PaperLength=2970|PaperWidth=2100|Scale=100|PaperSource=7|PrintQuality=600|MediaType=1|DitherType=10|PaperKind=A4|PrintScaleMode=1
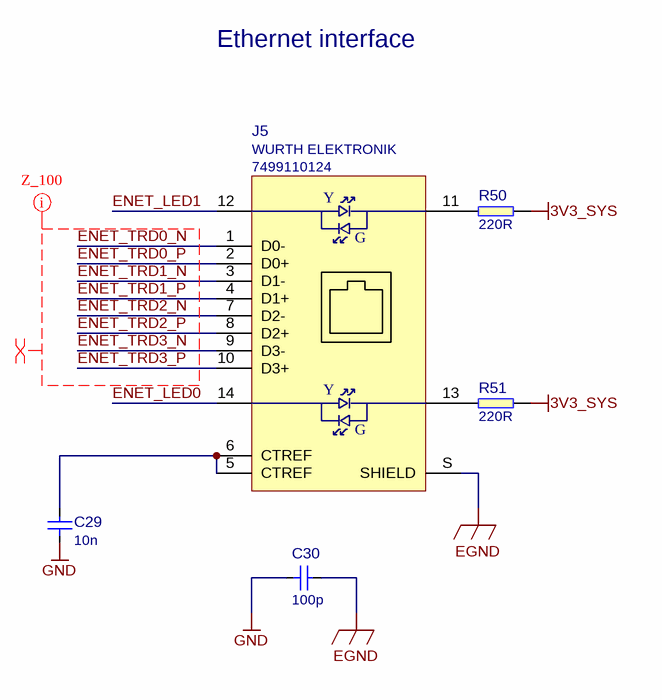
[diagram p2: ethernet.SchDoc]

### Parts
C29  10n  [0603]
C30  100p  [0603]
J5  Manufacturer: WURTH ELEKTRONIK  PartSymbol: 7499110124  [WE_7499110124]  (hidden comment: WE_7499110124)
R50  220R  [0402]
R51  220R  [0402]

### Nets
3V3_SYS: R50.2 R51.1
EGND: C30.2 J5.S(SHIELD)
GND: C29.1 C30.1
ENET_LED0: J5.14
ENET_LED1: J5.12
ENET_TRD0_N: J5.1(D0-)
ENET_TRD0_P: J5.2(D0+)
ENET_TRD1_N: J5.3(D1-)
ENET_TRD1_P: J5.4(D1+)
ENET_TRD2_N: J5.7(D2-)
ENET_TRD2_P: J5.8(D2+)
ENET_TRD3_N: J5.9(D3-)
ENET_TRD3_P: J5.10(D3+)
NetC29_2: C29.2 J5.5(CTREF) J5.6(CTREF)
NetJ5_11: J5.11 R50.1
NetJ5_13: J5.13 R51.2

### Layout directives
net class Z_100: ENET_TRD0_N, ENET_TRD0_P, ENET_TRD1_N, ENET_TRD1_P, ENET_TRD2_N, ENET_TRD2_P, ENET_TRD3_N, ENET_TRD3_P
differential pair: ENET_TRD0_N, ENET_TRD0_P, ENET_TRD1_N, ENET_TRD1_P, ENET_TRD2_N, ENET_TRD2_P, ENET_TRD3_N, ENET_TRD3_P

### Notes on the sheet
- Ethernet interface
- Title:
- Size:
- Date:
- A3
- Revision:
- Page:
- of
- Antmicro Ltd.
- File:
- www.antmicro.com
- (in symbol WE_7499111447) Y; G

### Library data of the parts
C29 = C_10n_0603: MLCC SMT Capacitor 10 nF 0603; Manufacturer: AVX; PartSymbol: 06031C103JAT2A; PartNumber: C_10n_0603; Value: 10n
C30 = C_100p_0603: MLCC SMT Capacitor 100pF 0603; Manufacturer: Walsin; PartSymbol: 0603N101J500CT; PartNumber: C_100p_0603; Value: 100p
J5 = WE_7499111447: LAN-Transformer WE-RJ45LAN 10/100/1000 BaseT; PartNumber: WE_7499110124; Value: WE_7499110124
R50 R51 = R_220R_0402: RES, 220R, 0402; Manufacturer: TE Connectivity; PartSymbol: CRG0402J220R; PartNumber: R_220R_0402; Value: 220R

## Sheet SoM.SchDoc
size A3; DocumentNumber: 4; SheetNumber: 4; SheetTotal: 6; PageSetup: Record=PageOptions|CenterHorizontal=True|CenterVertical=True|PrintScale=0.97|XCorrection=1.00|YCorrection=1.00|PrintKind=1|BorderSize=5000000|LeftOffset=0|BottomOffset=0|Orientation=2|PaperLength=2970|PaperWidth=2100|Scale=100|PaperSource=7|PrintQuality=600|MediaType=1|DitherType=10|PaperKind=A4|PrintScaleMode=1
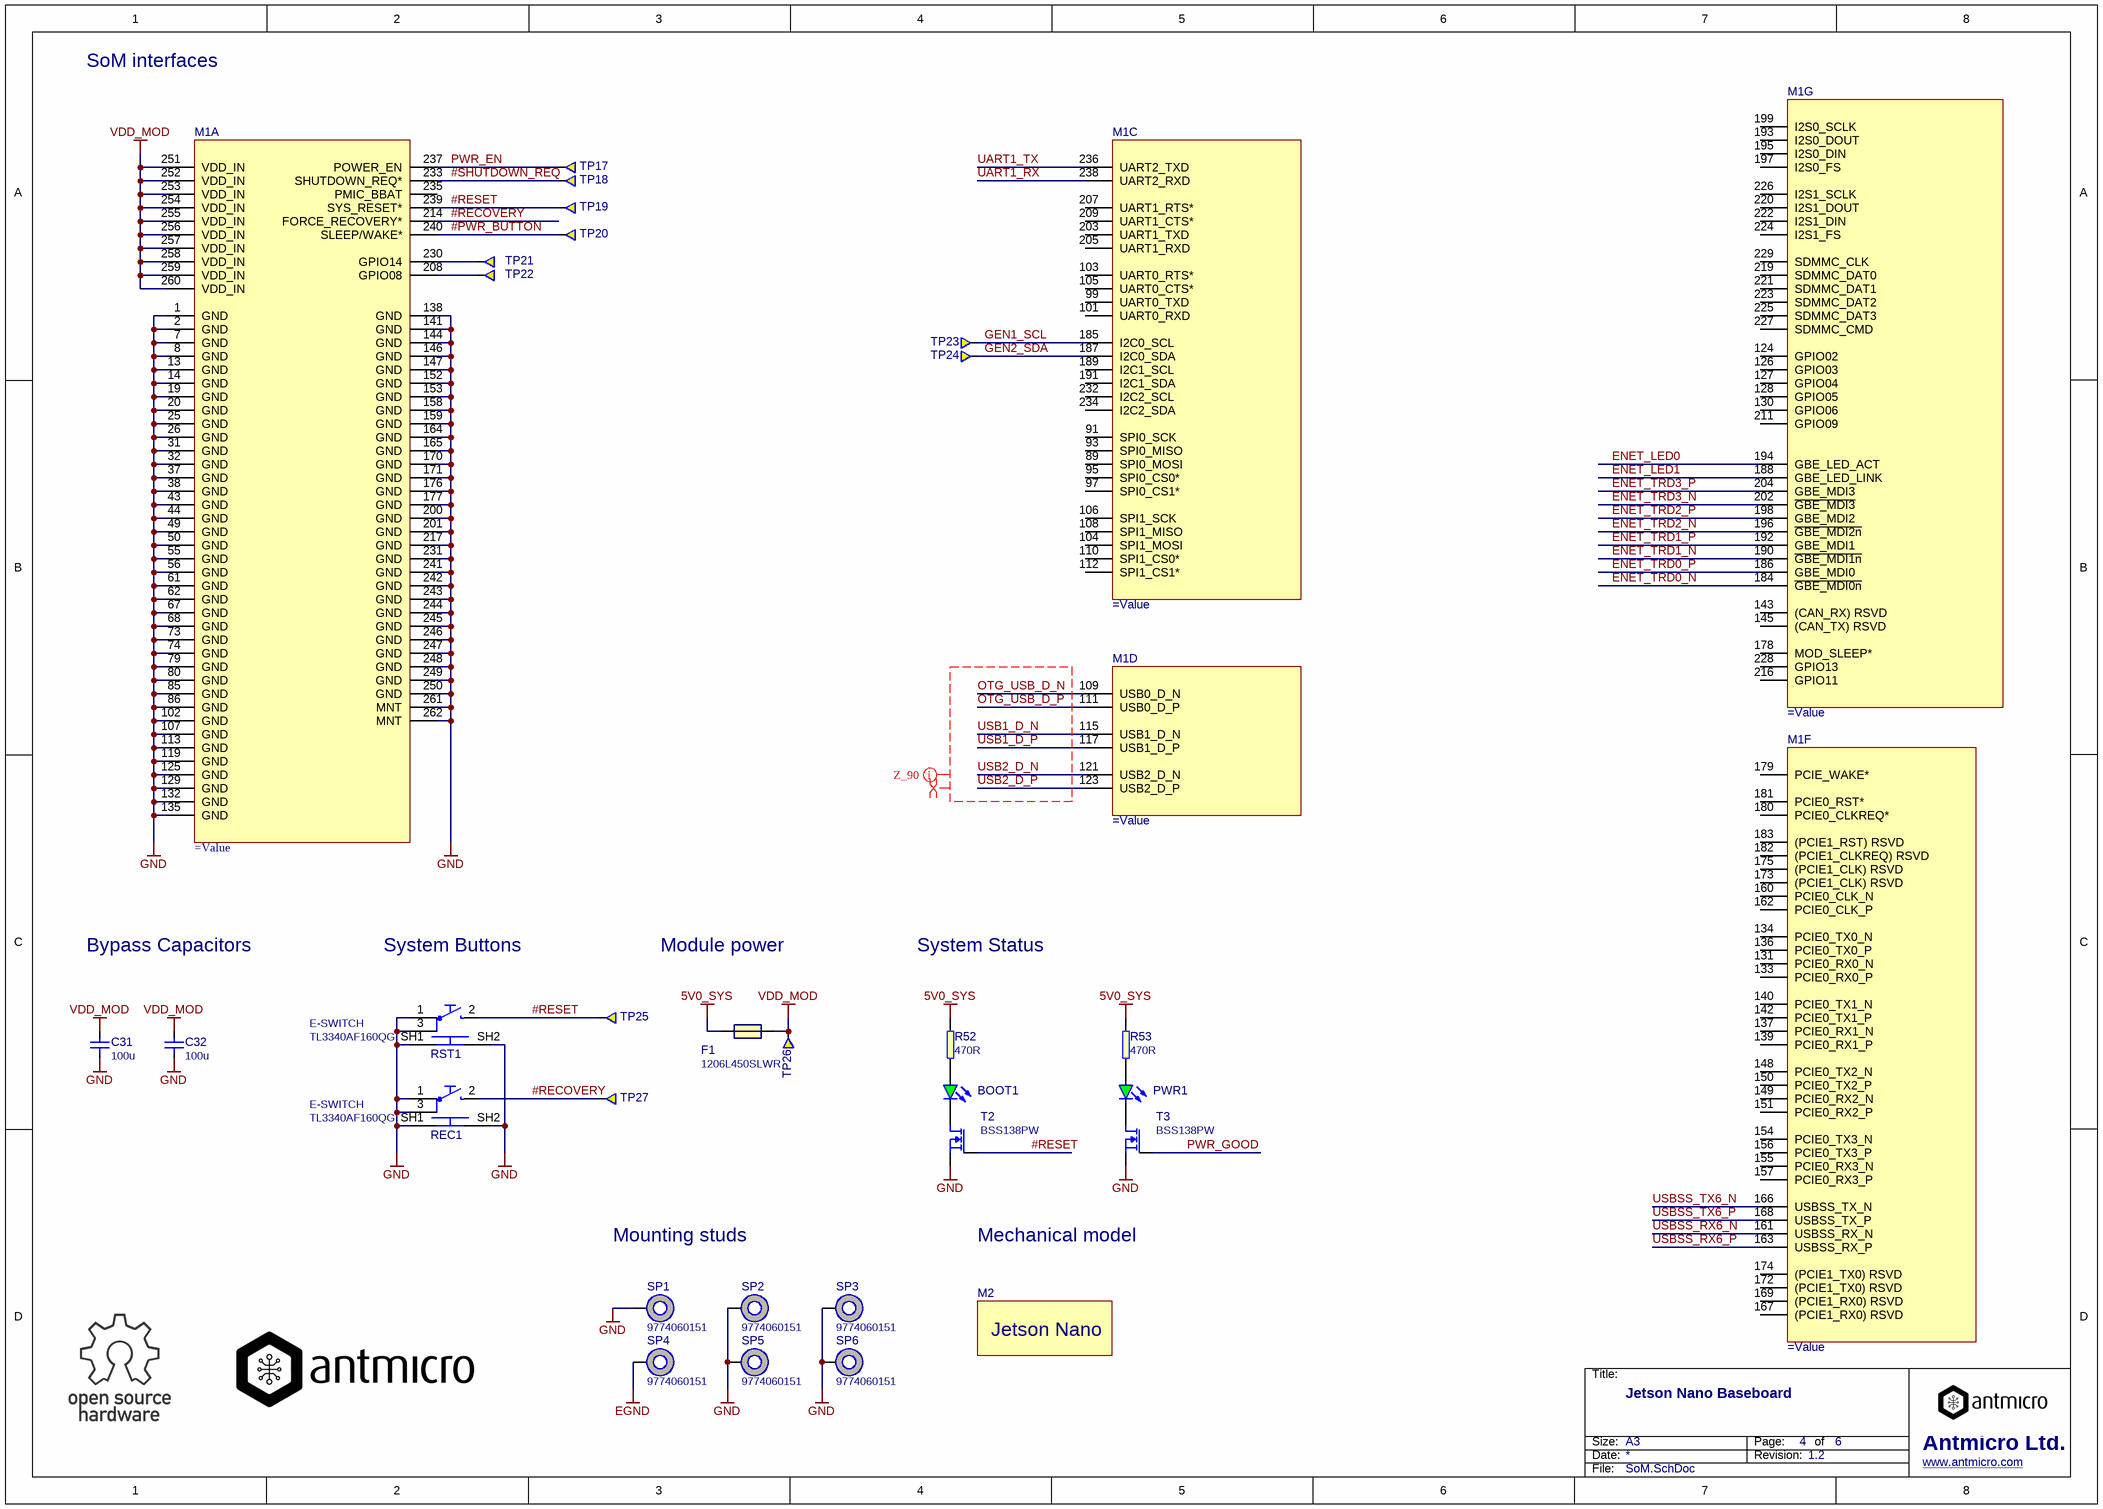
[diagram p3: SoM.SchDoc]

### Parts
BOOT1  KPT-1608SGC  [LED0603]  (value not drawn)
C31  100u  [1206]
C32  100u  [1206]
F1  PartSymbol: 1206L450SLWR  (hidden comment: Value)
M1  (no value)  [jetson-nano-connector]  (parts A,C,D,F,G of 7)
M2  (no value)  [jetson-nano-module]
PWR1  KPT-1608SGC  [LED0603]  (value not drawn)
R52  470R  [0402]
R53  470R  [0402]
REC1  Manufacturer: E-SWITCH  [TL3340AF160QG]  (hidden comment: TL3340AF160QG)
RST1  Manufacturer: E-SWITCH  [TL3340AF160QG]  (hidden comment: TL3340AF160QG)
SP1  9774060151  [M2.5-6mm]
SP2  9774060151  [M2.5-6mm]
SP3  9774060151  [M2.5-6mm]
SP4  9774060151  [M2.5-6mm]
SP5  9774060151  [M2.5-6mm]
SP6  9774060151  [M2.5-6mm]
T2  BSS138PW  [SC70-3]
T3  BSS138PW  [SC70-3]
TP17  Testpad  [TP-R-1.5]  (value not drawn)  (no BOM)
TP18  Testpad  [TP-R-1.5]  (value not drawn)  (no BOM)
TP19  Testpad  [TP-R-1.5]  (value not drawn)  (no BOM)
TP20  Testpad  [TP-R-1.5]  (value not drawn)  (no BOM)
TP21  Testpad  [TP-R-1.5]  (value not drawn)  (no BOM)
TP22  Testpad  [TP-R-1.5]  (value not drawn)  (no BOM)
TP23  Testpad  [TP-R-1.5]  (value not drawn)  (no BOM)
TP24  Testpad  [TP-R-1.5]  (value not drawn)  (no BOM)
TP25  Testpad  [TP-R-1.5]  (value not drawn)  (no BOM)
TP26  Testpad  [TP-R-1.5]  (value not drawn)  (no BOM)
TP27  Testpad  [TP-R-1.5]  (value not drawn)  (no BOM)

### Nets
5V0_SYS: F1.1 R52.2 R53.2
EGND: SP4.1
GND: C31.1 C32.1 M1.1(GND) M1.2(GND) M1.7(GND) M1.8(GND) M1.13(GND) M1.14(GND) M1.19(GND) M1.20(GND) M1.25(GND) M1.26(GND) M1.31(GND) M1.32(GND) M1.37(GND) M1.38(GND) M1.43(GND) M1.44(GND) M1.49(GND) M1.50(GND) M1.55(GND) M1.56(GND) M1.61(GND) M1.62(GND) M1.67(GND) M1.68(GND) M1.73(GND) M1.74(GND) M1.79(GND) M1.80(GND) M1.85(GND) M1.86(GND) M1.102(GND) M1.107(GND) M1.113(GND) M1.119(GND) M1.125(GND) M1.129(GND) M1.132(GND) M1.135(GND) M1.138(GND) M1.141(GND) M1.144(GND) M1.146(GND) M1.147(GND) M1.152(GND) M1.153(GND) M1.158(GND) M1.159(GND) M1.164(GND) M1.165(GND) M1.170(GND) M1.171(GND) M1.176(GND) M1.177(GND) M1.200(GND) M1.201(GND) M1.217(GND) M1.231(GND) M1.241(GND) M1.242(GND) M1.243(GND) M1.244(GND) M1.245(GND) M1.246(GND) M1.247(GND) M1.248(GND) M1.249(GND) M1.250(GND) M1.261(MNT) M1.262(MNT) REC1.1 REC1.3 REC1.SH1 REC1.SH2 RST1.1 RST1.3 RST1.SH1 RST1.SH2 SP1.1 SP2.1 SP3.1 SP5.1 SP6.1 T2.2(S) T3.2(S)
VDD_MOD: C31.2 C32.2 F1.2 M1.251(VDD_IN) M1.252(VDD_IN) M1.253(VDD_IN) M1.254(VDD_IN) M1.255(VDD_IN) M1.256(VDD_IN) M1.257(VDD_IN) M1.258(VDD_IN) M1.259(VDD_IN) M1.260(VDD_IN) TP26.1
#PWR_BUTTON: M1.240(SLEEP/WAKE*) TP20.1
#RECOVERY: M1.214(FORCE_RECOVERY*) REC1.2 TP27.1
#RESET: M1.239(SYS_RESET*) RST1.2 T2.1(G) TP19.1 TP25.1
#SHUTDOWN_REQ: M1.233(SHUTDOWN_REQ*) TP18.1
ENET_LED0: M1.194(GBE_LED_ACT)
ENET_LED1: M1.188(GBE_LED_LINK)
ENET_TRD0_N: M1.184(~{GBE_MDI0n})
ENET_TRD0_P: M1.186(GBE_MDI0)
ENET_TRD1_N: M1.190(~{GBE_MDI1n})
ENET_TRD1_P: M1.192(GBE_MDI1)
ENET_TRD2_N: M1.196(~{GBE_MDI2n})
ENET_TRD2_P: M1.198(GBE_MDI2)
ENET_TRD3_N: M1.202(~{GBE_MDI3})
ENET_TRD3_P: M1.204(GBE_MDI3)
GEN1_SCL: M1.185(I2C0_SCL) TP23.1
GEN2_SDA: M1.187(I2C0_SDA) TP24.1
OTG_USB_D_N: M1.109(USB0_D_N)
OTG_USB_D_P: M1.111(USB0_D_P)
PWR_EN: M1.237(POWER_EN) TP17.1
PWR_GOOD: T3.1(G)
UART1_RX: M1.238(UART2_RXD)
UART1_TX: M1.236(UART2_TXD)
USB1_D_N: M1.115(USB1_D_N)
USB1_D_P: M1.117(USB1_D_P)
USB2_D_N: M1.121(USB2_D_N)
USB2_D_P: M1.123(USB2_D_P)
USBSS_RX6_N: M1.161(USBSS_RX_N)
USBSS_RX6_P: M1.163(USBSS_RX_P)
USBSS_TX6_N: M1.166(USBSS_TX_N)
USBSS_TX6_P: M1.168(USBSS_TX_P)
NetBOOT1_A: BOOT1.A R52.1
NetBOOT1_K: BOOT1.K T2.3(D)
NetM1_208: M1.208(GPIO08) TP22.1
NetM1_230: M1.230(GPIO14) TP21.1
NetPWR1_A: PWR1.A R53.1
NetPWR1_K: PWR1.K T3.3(D)

Not connected (* = marked no-connect by the designer): M1 89(SPI0_MOSI) 91(SPI0_SCK) 93(SPI0_MISO) 95(SPI0_CS0*) 97(SPI0_CS1*) 99(UART0_TXD) 101(UART0_RXD) 103(UART0_RTS*) 104(SPI1_MOSI) 105(UART0_CTS*) 106(SPI1_SCK) 108(SPI1_MISO) 110(SPI1_CS0*) 112(SPI1_CS1*) 124(GPIO02) 126(GPIO03) 127(GPIO04) 128(GPIO05) 130(GPIO06) 131(PCIE0_RX0_N) 133(PCIE0_RX0_P) 134(PCIE0_TX0_N) 136(PCIE0_TX0_P) 137(PCIE0_RX1_N) 139(PCIE0_RX1_P) 140(PCIE0_TX1_N) 142(PCIE0_TX1_P) 143((CAN_RX)_RSVD) 145((CAN_TX)_RSVD) 148(PCIE0_TX2_N) 149(PCIE0_RX2_N) 150(PCIE0_TX2_P) 151(PCIE0_RX2_P) 154(PCIE0_TX3_N) 155(PCIE0_RX3_N) 156(PCIE0_TX3_P) 157(PCIE0_RX3_P) 160(PCIE0_CLK_N) 162(PCIE0_CLK_P) 167((PCIE1_RX0)_RSVD) 169((PCIE1_RX0)_RSVD) 172((PCIE1_TX0)_RSVD) 173((PCIE1_CLK)_RSVD) 174((PCIE1_TX0)_RSVD) 175((PCIE1_CLK)_RSVD) 178(MOD_SLEEP*) 179(PCIE_WAKE*) 180(PCIE0_CLKREQ*) 181(PCIE0_RST*) 182((PCIE1_CLKREQ)_RSVD) 183((PCIE1_RST)_RSVD) 189(I2C1_SCL) 191(I2C1_SDA) 193(I2S0_DOUT) 195(I2S0_DIN) 197(I2S0_FS) 199(I2S0_SCLK) 203(UART1_TXD) 205(UART1_RXD) 207(UART1_RTS*) 209(UART1_CTS*) 211(GPIO09) 216(GPIO11) 219(SDMMC_DAT0) 220(I2S1_DOUT) 221(SDMMC_DAT1) 222(I2S1_DIN) 223(SDMMC_DAT2) 224(I2S1_FS) 225(SDMMC_DAT3) 226(I2S1_SCLK) 227(SDMMC_CMD) 228(GPIO13) 229(SDMMC_CLK) 232(I2C2_SCL) 234(I2C2_SDA) 235(PMIC_BBAT)

### Layout directives
differential pair: OTG_USB_D_N, OTG_USB_D_P, USB1_D_N, USB1_D_P, USB2_D_N, USB2_D_P
net class Z_90: OTG_USB_D_N, OTG_USB_D_P, USB1_D_N, USB1_D_P, USB2_D_N, USB2_D_P

### Notes on the sheet
- SoM interfaces
- Bypass Capacitors
- System Buttons
- Module power
- System Status
- Mounting studs
- Mechanical model
- Title:
- Size:
- Date:
- A3
- Revision:
- Page:
- of
- Antmicro Ltd.
- File:
- www.antmicro.com
- (in symbol jetson-nano-module) Jetson Nano

### Library data of the parts
BOOT1 PWR1 = LED: LED Green 0603 case; PartNumber: LED_G; Manufacturer: KINGBRIGHT; Value: KPT-1608SGC; PartSymbol: KPT-1608SGC
C31 C32 = C_100u_1206: MLCC SMT Capacitor 100uF 1206; Manufacturer: VISHAY; PartSymbol: TMCMA0J107MTRF; PartNumber: C_100u_1206; Value: 100u
F1 = Fuse: PTC RESET 6V LO RHO 1206 4.50A; PartNumber: LITTELFUSE_1206L450SLWR; Manufacturer: LITTELFUSE; Value: 1206L450SLWR
M1 = Jetson-Nano-new-release: PartNumber: jetson-nano-new-release
M2 = jetson-nano-module: PartNumber: jetson-nano-module
R52 R53 = R_470R_0402: RES, 470R, 0402; Manufacturer: VISHAY; PartSymbol: CRCW0402470RFKED.; PartNumber: R_470R_0402; Value: 470R
REC1 RST1 = TL3340AF160QG: E-SWITCH  TL3340AF160QG  SWITCH, TACTILE SPST 50mA, SMD GULL WING; Value: TL3340AF160QG; PartNumber: TL3340AF160QG; PartSymbol: TL3340AF160QG
SP1-SP6 = SPACER: M2.5-6mm; PartNumber: M2.5x6; Manufacturer: WURTH ELEKTRONIK; Value: 9774060151; PartSymbol: 9774060151
T2 T3 = NMOS: as T1 on sheet display; Value: BSS138PW; PartNumber: BSS138PW; PartSymbol: BSS138PW
TP17-TP27 = Testpad: Testpad, round, 1.5mm; PartNumber: TP-R-1.5

## Sheet supply.SchDoc
size A3; DocumentNumber: 5; SheetNumber: 5; SheetTotal: 6; PageSetup: Record=PageOptions|CenterHorizontal=True|CenterVertical=True|PrintScale=0.97|XCorrection=1.00|YCorrection=1.00|PrintKind=1|BorderSize=5000000|LeftOffset=0|BottomOffset=0|Orientation=2|PaperLength=2970|PaperWidth=2100|Scale=100|PaperSource=7|PrintQuality=600|MediaType=1|DitherType=10|PaperKind=A4|PrintScaleMode=1
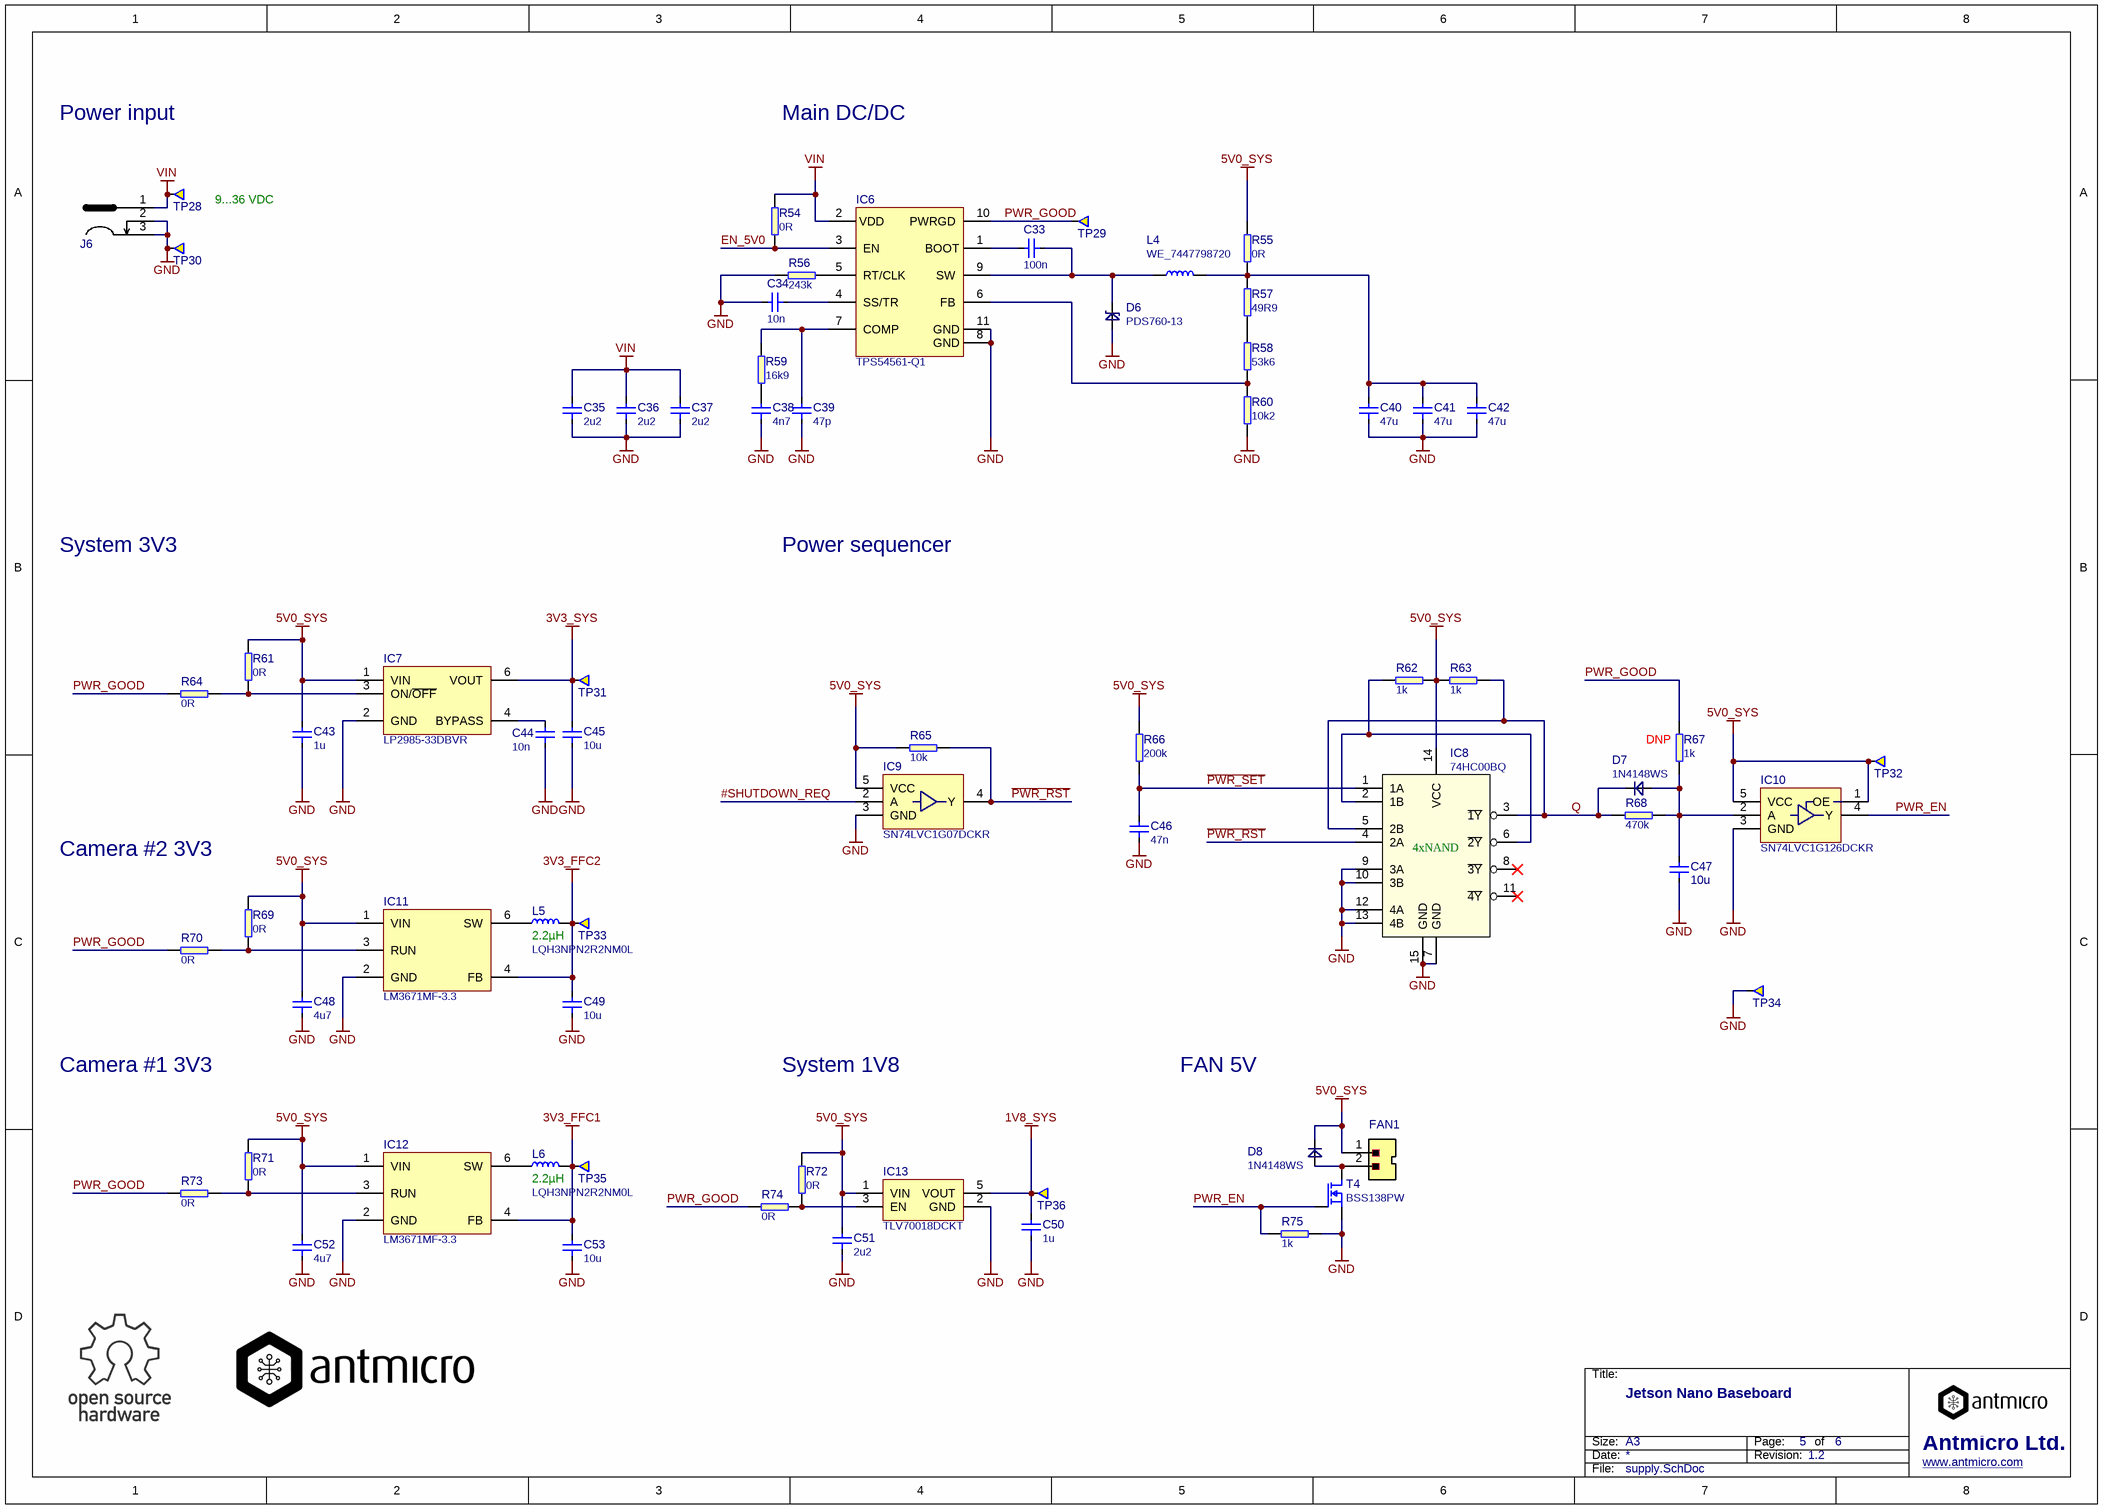
[diagram p4: supply.SchDoc]

### Parts
C33  100n  [0603]
C34  10n  [0402]
C35  2u2  [1206]
C36  2u2  [1206]
C37  2u2  [1206]
C38  4n7  [0402]
C39  47p  [0402]
C40  47u  [0805]
C41  47u  [0805]
C42  47u  [0805]
C43  1u  [0603]
C44  10n  [0402]
C45  10u  [0402]
C46  47n  [0402]
C47  10u  [0402]
C48  4u7  [0603]
C49  10u  [0603]
C50  1u  [0402]
C51  2u2  [0402]
C52  4u7  [0603]
C53  10u  [0603]
D6  PDS760-13  [PowerDI]
D7  1N4148WS  [SOD-323]
D8  1N4148WS  [SOD-323]
FAN1  MX-22-23-2021  [molex_2223-2021]  (value not drawn)
IC6  TPS54561-Q1  [WSON-10_4x4]
IC7  LP2985-33DBVR  [SOT23-5N]
IC8  74HC00BQ  [DHVQFN14]
IC9  SN74LVC1G07DCKR  [R-PDSO-G5]
IC10  SN74LVC1G126DCKR  [R-PDSO-G5]
IC11  LM3671MF-3.3  [SOT23-5N]
IC12  LM3671MF-3.3  [SOT23-5N]
IC13  TLV70018DCKT  [SC70-5]
J6  MJ-179PH  [DC_SOCKET]  (value not drawn)
L4  WE_7447798720  [WE_7447798720]
L5  LQH3NPN2R2NM0L  [LQH3NPN2R2NM]
L6  LQH3NPN2R2NM0L  [LQH3NPN2R2NM]
R54  0R  [0402]
R55  0R  [1206]
R56  243k  [0402]
R57  49R9  [0402]
R58  53k6  [0402]
R59  16k9  [0402]
R60  10k2  [0402]
R61  0R  [0402]
R62  1k  [0402]
R63  1k  [0402]
R64  0R  [0402]
R65  10k  [0402]
R66  200k  [0402]
R67  1k  [0402]
R68  470k  [0603]
R69  0R  [0402]
R70  0R  [0402]
R71  0R  [0402]
R72  0R  [0402]
R73  0R  [0402]
R74  0R  [0402]
R75  1k  [0402]
T4  BSS138PW  [SC70-3]
TP28  Testpad  [TP-R-1.5]  (value not drawn)  (no BOM)
TP29  Testpad  [TP-R-1.5]  (value not drawn)  (no BOM)
TP30  Testpad  [TP-R-1.5]  (value not drawn)  (no BOM)
TP31  Testpad  [TP-R-1.5]  (value not drawn)  (no BOM)
TP32  Testpad  [TP-R-1.5]  (value not drawn)  (no BOM)
TP33  Testpad  [TP-R-1.5]  (value not drawn)  (no BOM)
TP34  Testpad  [TP-R-1.5]  (value not drawn)  (no BOM)
TP35  Testpad  [TP-R-1.5]  (value not drawn)  (no BOM)
TP36  Testpad  [TP-R-1.5]  (value not drawn)  (no BOM)

### Nets
1V8_SYS: C50.2 IC13.5(VOUT) TP36.1
3V3_FFC1: C53.2 IC12.4(FB) L6.2 TP35.1
3V3_FFC2: C49.2 IC11.4(FB) L5.2 TP33.1
3V3_SYS: C45.2 IC7.6(VOUT) TP31.1
5V0_SYS: C43.2 C48.2 C51.2 C52.2 D8.C FAN1.1 IC7.1(VIN) IC8.14(VCC) IC9.5(VCC) IC10.1(OE) IC10.5(VCC) IC11.1(VIN) IC12.1(VIN) IC13.1(VIN) R55.2 R61.2 R62.1 R63.2 R65.1 R66.2 R69.2 R71.2 R72.1 TP32.1
GND: C34.2 C35.1 C36.1 C37.1 C38.1 C39.1 C40.1 C41.1 C42.1 C43.1 C44.1 C45.1 C46.1 C47.1 C48.1 C49.1 C50.1 C51.1 C52.1 C53.1 D6.A IC6.8(GND) IC6.11(GND) IC7.2(GND) IC8.7(GND) IC8.9(3A) IC8.10(3B) IC8.12(4A) IC8.13(4B) IC8.15(GND) IC9.3(GND) IC10.3(GND) IC11.2(GND) IC12.2(GND) IC13.2(GND) J6.2 J6.3 R56.2 R60.1 R75.1 T4.2(S) TP30.1 TP34.1
VIN: C35.2 C36.2 C37.2 IC6.2(VDD) J6.1 R54.2 TP28.1
#SHUTDOWN_REQ: IC9.2(A)
~{PWR_RST}: IC8.4(2A) IC9.4(Y) R65.2
~{PWR_SET}: C46.2 IC8.1(1A) R66.1
EN_5V0: IC6.3(EN) R54.1
PWR_EN: IC10.4(Y) R75.2 T4.1(G)
PWR_GOOD: IC6.10(PWRGD) R64.2 R67.1 R70.2 R73.2 R74.2 TP29.1
Q: D7.C IC8.3(~{1Y}) IC8.5(2B) R63.1 R68.1
NetC33_1: C33.1 D6.C IC6.9(SW) L4.1
NetC33_2: C33.2 IC6.1(BOOT)
NetC34_1: C34.1 IC6.4(SS/TR)
NetC38_2: C38.2 R59.1
NetC39_2: C39.2 IC6.7(COMP) R59.2
NetC40_2: C40.2 C41.2 C42.2 L4.2 R55.1 R57.2
NetC44_2: C44.2 IC7.4(BYPASS)
NetC47_2: C47.2 D7.A IC10.2(A) R67.2 R68.2
NetD8_A: D8.A FAN1.2 T4.3(D)
NetIC6_5: IC6.5(RT/CLK) R56.1
NetIC6_6: IC6.6(FB) R58.1 R60.2
NetIC7_3: IC7.3(ON/~{OFF}) R61.1 R64.1
NetIC8_2: IC8.2(1B) IC8.6(~{2Y}) R62.2
NetIC11_3: IC11.3(RUN) R69.1 R70.1
NetIC11_6: IC11.6(SW) L5.1
NetIC12_3: IC12.3(RUN) R71.1 R73.1
NetIC12_6: IC12.6(SW) L6.1
NetIC13_3: IC13.3(EN) R72.2 R74.1
NetR57_1: R57.1 R58.2

Not connected (* = marked no-connect by the designer): IC8 8(~{3Y})* 11(~{4Y})*

### Notes on the sheet
- Power input
- Main DC/DC
- 9...36 VDC
- System 3V3
- Power sequencer
- (near R67) DNP
- Camera #2 3V3
- (near L5) 2.2µH
- Camera #1 3V3
- System 1V8
- FAN 5V
- (near L6) 2.2µH
- Title:
- Size:
- Date:
- A3
- Revision:
- Page:
- of
- Antmicro Ltd.
- File:
- www.antmicro.com
- (in symbol 74HC00BQ) 4xNAND

### Library data of the parts
C33 = C_100n_0603: as C26 on sheet display; PartNumber: C_100n_0603; Value: 100n
C34 C44 = C_10n_0402: MLCC SMT Capacitor 10 nF 0402; Manufacturer: AVX; PartSymbol: 04025G103ZAT2A; PartNumber: C_10n_0402; Value: 10n
C35-C37 = C_2u2_1206: MLCC SMT Capacitor 2.2uF 1206; Manufacturer: KEMET; PartSymbol: C1206C225J5RACTU; PartNumber: C_2u2_1206; Value: 2u2
C38 = C_4n7_0402: MLCC SMT Capacitor 4.7 nF 0402; Manufacturer: TDK; PartSymbol: CGA2B3X7S2A472K050BB; PartNumber: C_4n7_0402; Value: 4n7
C39 = C_47p_0402: MLCC SMT Capacitor 47pF 0402; Manufacturer: KEMET; PartSymbol: C0402C470J5GACTU; PartNumber: C_47p_0402; Value: 47p
C40-C42 = C_47u_0805: MLCC SMT Capacitor 47uF 0805; Manufacturer: KEMET; PartSymbol: C0805C476M9PACTU; PartNumber: C_47u_0805; Value: 47u
C43 = C_1u_0603: MLCC SMT Capacitor 1uF 0603; Manufacturer: KEMET; PartSymbol: C0603C105M4PACTU; Value: 1u; PartNumber: C_1u_0603
C45 C47 = C_10u_0402: MLCC SMT Capacitor 10uF 0402; Manufacturer: TDK; PartSymbol: C1005X5R0J106M050BC; Value: 10u; PartNumber: C_10u_0402
C46 = C_47n_0402: MLCC SMT Capacitor 47nF 0402; Manufacturer: MULTICOMP; PartSymbol: MC0402X473K160CT; PartNumber: C_47n_0402; Value: 47n
C48 C52 = C_4u7_0603: MLCC SMT Capacitor 4.7uF 0603; Manufacturer: MULTICOMP; PartSymbol: MC0603X475K6R3CT; Value: 4u7; PartNumber: C_4u7_0603
C49 C53 = C_10u_0603: MLCC SMT Capacitor 10uF 0603; Manufacturer: Walsin; PartSymbol: 0603X106M6R3CT; Value: 10u; PartNumber: C_10u_0603
C50 = C_1u_0402: MLCC SMT Capacitor 1uF 0402; Manufacturer: MULTICOMP; PartSymbol: MC0402F105Z6R3CT; Value: 1u; PartNumber: C_1u_0402
C51 = C_2u2_0402: MLCC SMT Capacitor 2.2uF 0402; Manufacturer: TDK; PartSymbol: C1005X5R1A225K050BC; Value: 2u2; PartNumber: C_2u2_0402
D6 = Diode Schottky: DIODE SCHOTTKY 60V 7A POWERDI5; Manufacturer: DIODES INC.; PartNumber: PDS760-13; Value: PDS760-13; PartSymbol: PDS760-13
D7 D8 = diode: as D1 on sheet display; PartNumber: 1N4148WS; Value: 1N4148WS; PartSymbol: 1N4148WS
FAN1 = molex_2223-2021: Pinhead connector with key; Manufacturer: Molex; PartSymbol: 022232021 A-6373-02A222; Value: MX-22-23-2021; PartNumber: molex_2223-2021
IC6 = TPS54561: IC REG BCK SPLIT RAIL ADJ 10WSON; Manufacturer: Texas Instruments; PartNumber: TPS54561-Q1; Value: TPS54561-Q1; PartSymbol: TPS54561-Q1
IC7 = LP2992AIM5-3.3: Fixed LDO Voltage Regulator, 2.2V to 16V, 280mV Dropout, 3.3Vout, 150mAout, SOT-23-5; Manufacturer: Texas Instruments; Value: LP2985-33DBVR; PartNumber: LP2985-33DBVR; PartSymbol: LP2985-33DBVR
IC8 = 74HC00BQ: 2 NAND Gate, 4 channel; Manufacturer: NEXPERIA; PartNumber: 74HC00BQ; Value: 74HC00BQ; PartSymbol: 74HC00BQ
IC9 = SN74LVC1G07: Buffer, open drain; Manufacturer: Texas Instruments; PartSymbol: SN74LVC1G07GW; PartNumber: SN74LVC1G07DCKR; Value: SN74LVC1G07DCKR
IC10 = SN74LVC1G126: Buffer, tri-state; Manufacturer: Texas Instruments; PartNumber: SN74LVC1G126DCKR; Value: SN74LVC1G126DCKR; PartSymbol: SN74LVC1G126DCKR
IC11 IC12 = LM3671: DC/DC Buck Converter; Manufacturer: Texas Instruments; PartSymbol: LM3671MF-3.3/NOPB; Value: LM3671MF-3.3; PartNumber: LM3671MF-3.3
IC13 = TLV700: Voltage Regulator, 2V to 5.5V, 175mV Dropout, 1.8Vout, 200mAout; Manufacturer: Texas Instruments; Value: TLV70018DCKT; PartNumber: TLV70018DCKT; PartSymbol: TLV70018DCKT
J6 = DC_SOCKET: DC Power Connector, Jack, 4 A, 1.95 mm, PCB Mount, Through Hole; Manufacturer: MULTICOMP; PartNumber: DC_SOCKET; PartSymbol: MJ-179PH; Value: MJ-179PH
L4 = WE_7447798720: Fixed Inductors WE-PDF 1064 7.2uH 7.9A 12.8mOhm; Manufacturer: WURTH ELEKTRONIK; PartNumber: WE_7447798720; Value: WE_7447798720; RatedCurrent: 7.9A; Inductance: 7.2uH; PartSymbol: 7447798720
L5 L6 = LQH3NPN2R2NM0L: INDUCTOR, 2.2 ?H, ? 30%, 1212, 90 MHz, 0.073 ohm; Manufacturer: MURATA; Inductance: 2.2uH; Value: LQH3NPN2R2NM0L; PartNumber: LQH3NPN2R2NM0L; PartSymbol: LQH3NPN2R2NM0L
R54 R61 R64 R69-R74 = R_0R_0402: as R1 on sheet csi; PartNumber: R_0R_0402; Value: 0R
R55 = R_0R_1206: RES, 0R, 1206; Manufacturer: MULTICOMP; PartSymbol: MCMR12X000 PTL; PartNumber: R_0R_1206; Value: 0R
R56 = R_243k_0402: RES, 243k, 0402; Manufacturer: MULTICOMP; PartSymbol: MCMR04X2433FTL; PartNumber: R_243k_0402; Value: 243k
R57 = R_49R9_0402: RES, 49R9, 0402; Manufacturer: VISHAY; PartSymbol: CRCW040249R9FKED; PartNumber: R_49R9_0402; Value: 49R9
R58 = R_53k6_0402: RES, 53k6, 0402; Manufacturer: TE Connectivity; PartSymbol: CPF0402B53K6E1; PartNumber: R_53k6_0402; Value: 53k6
R59 = R_16k9_0402: RES, 16k9, 0402; Manufacturer: Panasonic; PartSymbol: ERA2AEB1692X; PartNumber: R_16k9_0402; Value: 16k9
R60 = R_10k2_0402: RES, 10k2, 0402, 0.1%; PartNumber: R_10k2_0402_0.1%; Manufacturer: TE Connectivity; PartSymbol: CPF0402B10K2E1; Value: 10k2; Tolerance: 0.1%
R62 R63 R67 R75 = R_1k_0402: RES, 1k, 0402; Manufacturer: BOURNS; PartSymbol: CR0402-FX-1001GLF; PartNumber: R_1k_0402; Value: 1k
R65 = R_10k_0402: as R35 on sheet display; PartNumber: R_10k_0402; Value: 10k
R66 = R_200k_0402: RES, 200k, 0402; Manufacturer: YAGEO; PartSymbol: RC0402FR-07200KL; PartNumber: R_200k_0402; Value: 200k
R68 = R_470k_0603: RES, 470k, 0603; Manufacturer: VISHAY; PartSymbol: CRCW0603470KFKEA; PartNumber: R_470k_0603; Value: 470k
T4 = NMOS: as T1 on sheet display; Value: BSS138PW; PartNumber: BSS138PW; PartSymbol: BSS138PW
TP28-TP36 = Testpad: Testpad, round, 1.5mm; PartNumber: TP-R-1.5

## Sheet usb-debug.SchDoc
size A3; DocumentNumber: 6; SheetNumber: 6; SheetTotal: 6; PageSetup: Record=PageOptions|CenterHorizontal=True|CenterVertical=True|PrintScale=0.97|XCorrection=1.00|YCorrection=1.00|PrintKind=1|BorderSize=5000000|LeftOffset=0|BottomOffset=0|Orientation=2|PaperLength=2970|PaperWidth=2100|Scale=100|PaperSource=7|PrintQuality=600|MediaType=1|DitherType=10|PaperKind=A4|PrintScaleMode=1
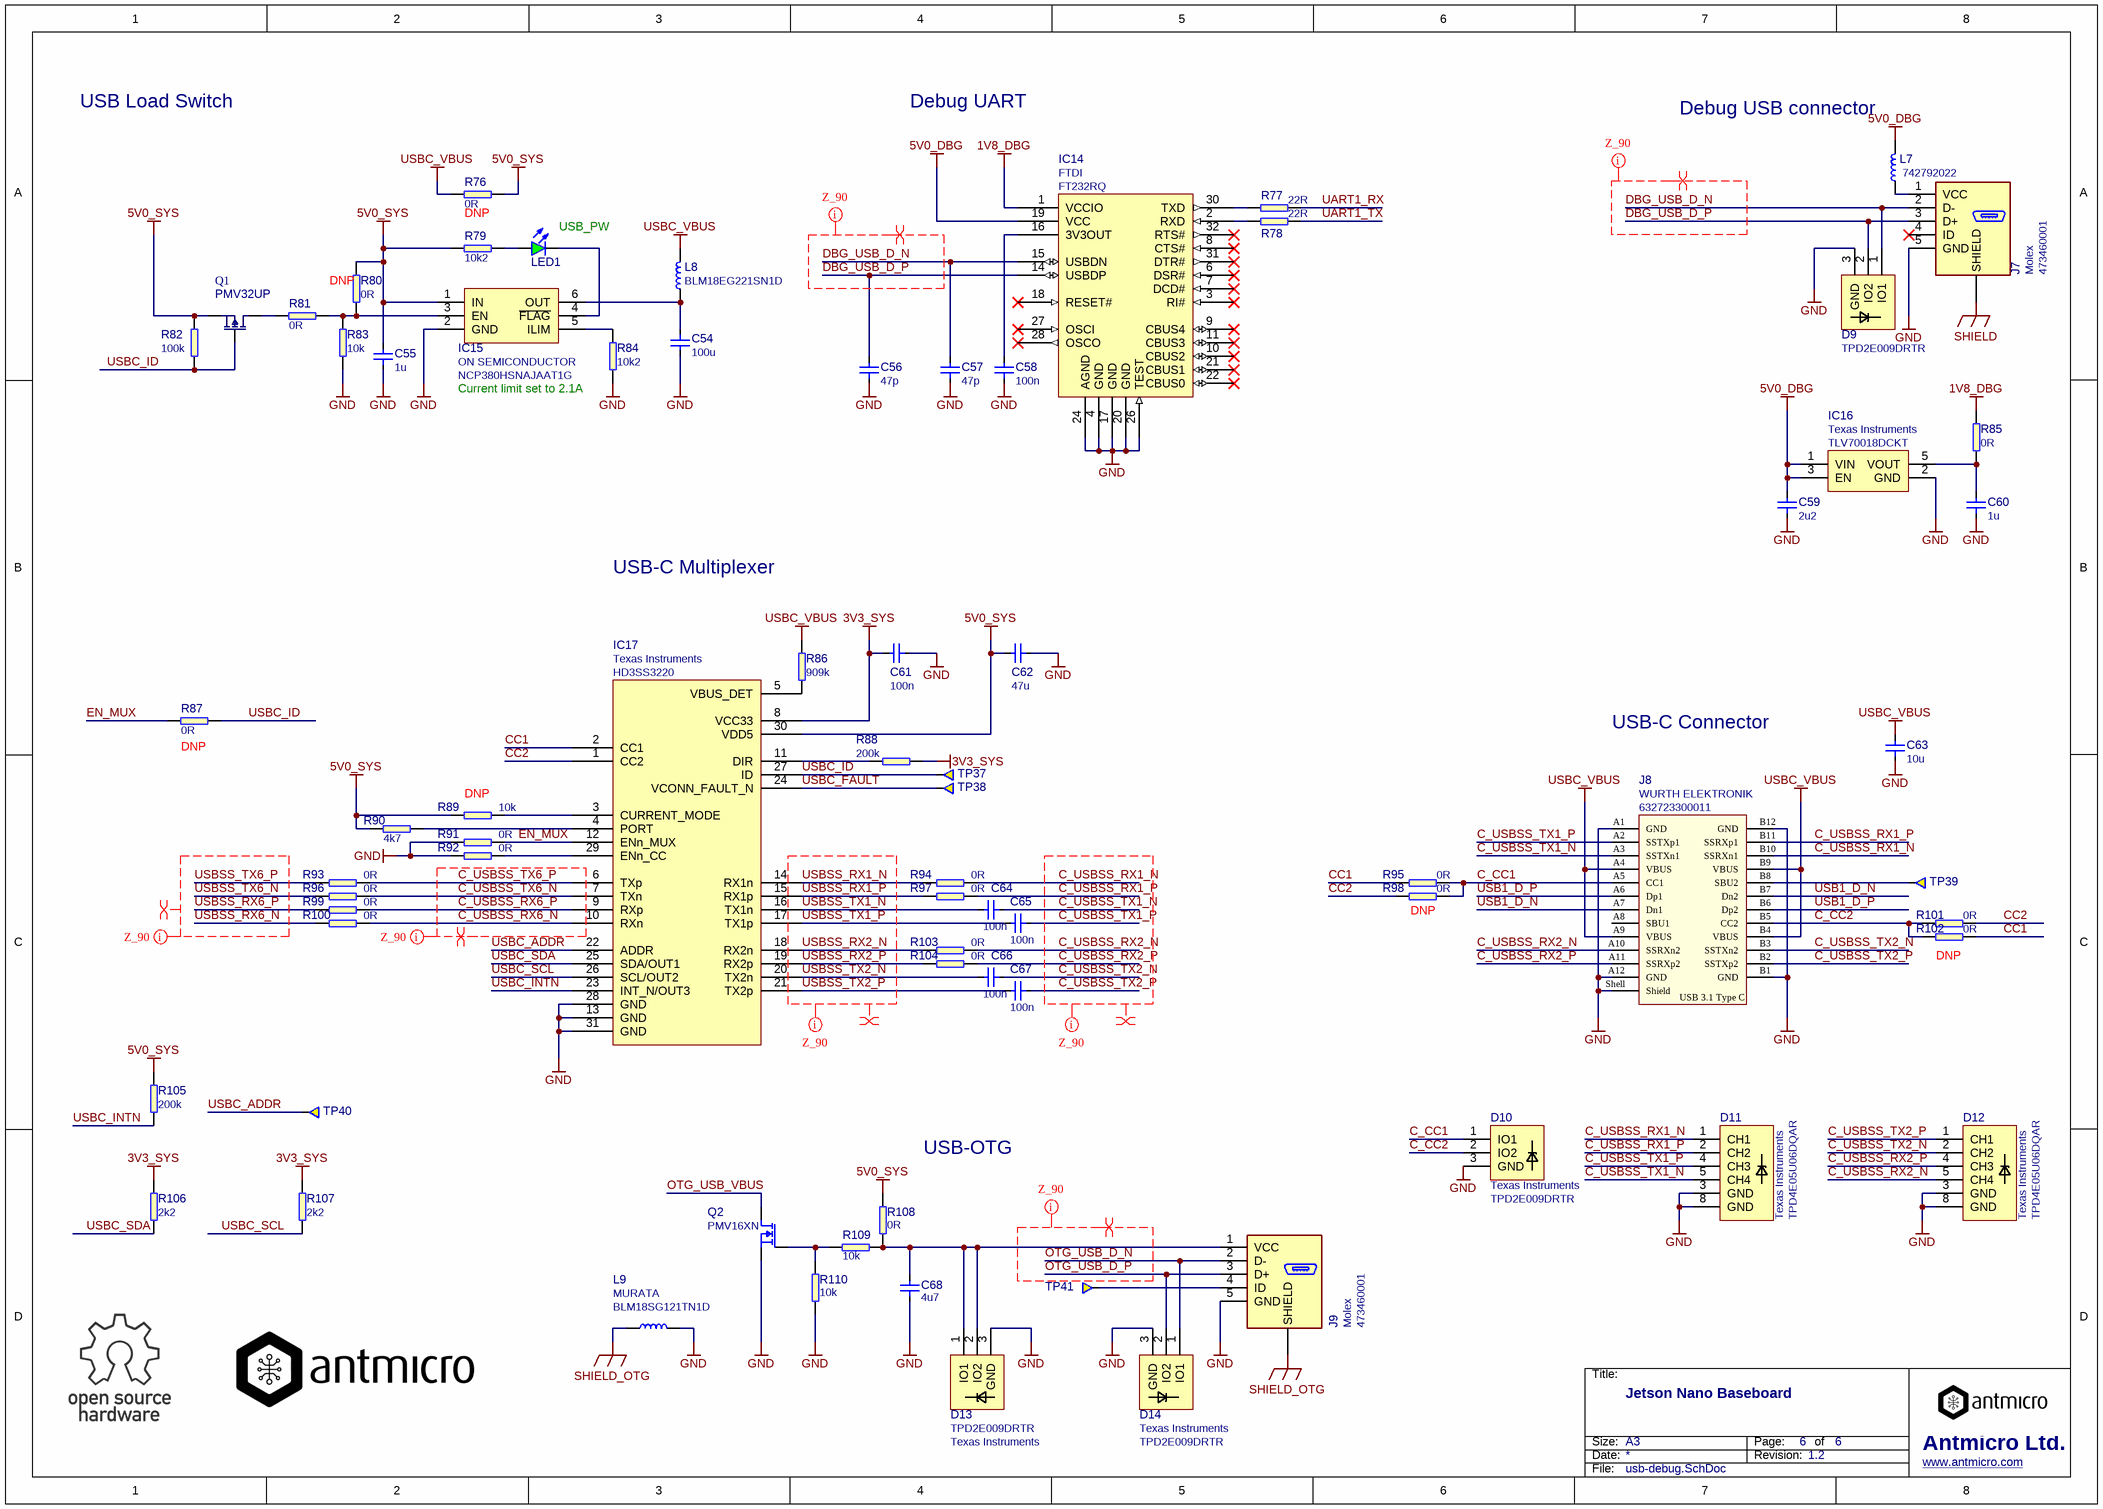
[diagram p5: usb-debug.SchDoc]

### Parts
C54  100u  [1210]
C55  1u  [0603]
C56  47p  [0603]
C57  47p  [0603]
C58  100n  [0603]
C59  2u2  [0402]
C60  1u  [0402]
C61  100n  [0603]
C62  47u  [0805]
C63  10u  [0603]
C64  100n  [0402]
C65  100n  [0402]
C66  100n  [0402]
C67  100n  [0402]
C68  4u7  [0603]
D9  TPD2E009DRTR  [SOT-3]
D10  TPD2E009DRTR  Manufacturer: Texas Instruments  [SOT-3]
D11  Manufacturer: Texas Instruments  PartSymbol: TPD4E05U06DQAR  [TPD4E05U06_PASS]  (hidden comment: TPD4E05U06)
D12  Manufacturer: Texas Instruments  PartSymbol: TPD4E05U06DQAR  [TPD4E05U06_PASS]  (hidden comment: TPD4E05U06)
D13  TPD2E009DRTR  Manufacturer: Texas Instruments  [SOT-3]
D14  TPD2E009DRTR  Manufacturer: Texas Instruments  [SOT-3]
IC14  Manufacturer: FTDI  [QFN-32]  (hidden comment: FT232RQ)
IC15  NCP380HSNAJAAT1G  Manufacturer: ON SEMICONDUCTOR  [TSOP-6]
IC16  TLV70018DCKT  Manufacturer: Texas Instruments  [SC70-5]
IC17  HD3SS3220  Manufacturer: Texas Instruments  [RNH0030A]
J7  Manufacturer: Molex  PartSymbol: 473460001  [CON-Molex-047346-0001]  (hidden comment: Molex 47346-0001)
J8  632723300011  Manufacturer: WURTH ELEKTRONIK  [WE_632723300011]
J9  Manufacturer: Molex  PartSymbol: 473460001  [CON-Molex-047346-0001]  (hidden comment: Molex 47346-0001)
L7  742792022  [0805]
L8  BLM18EG221SN1D  [0603]
L9  BLM18SG121TN1D  Manufacturer: MURATA  [0603]
LED1  KPT-1608SGC  [LED0603]  (value not drawn)
Q1  PMV32UP  [SOT-23]
Q2  PMV16XN  [SOT-23]
R76  0R  [0603]
R77  22R  [0402]
R78  22R  [0402]
R79  10k2  [0603]
R80  0R  [0402]
R81  0R  [0402]
R82  100k  [0603]
R83  10k  [0402]
R84  10k2  [0603]
R85  0R  [0603]
R86  909k  [0402]
R87  0R  [0402]
R88  200k  [0402]
R89  10k  [0402]
R90  4k7  [0402]
R91  0R  [0402]
R92  0R  [0402]
R93  0R  [0402]
R94  0R  [0402]
R95  0R  [0402]
R96  0R  [0402]
R97  0R  [0402]
R98  0R  [0402]
R99  0R  [0402]
R100  0R  [0402]
R101  0R  [0402]
R102  0R  [0402]
R103  0R  [0402]
R104  0R  [0402]
R105  200k  [0402]
R106  2k2  [0402]
R107  2k2  [0402]
R108  0R  [0402]
R109  10k  [0402]
R110  10k  [0402]
TP37  Testpad  [TP-R-1.5]  (value not drawn)  (no BOM)
TP38  Testpad  [TP-R-1.5]  (value not drawn)  (no BOM)
TP39  Testpad  [TP-R-1.5]  (value not drawn)  (no BOM)
TP40  Testpad  [TP-R-1.5]  (value not drawn)  (no BOM)
TP41  Testpad  [TP-R-1.5]  (value not drawn)  (no BOM)

### Nets
1V8_DBG: IC14.1(VCCIO) R85.2
3V3_SYS: C61.2 IC17.8(VCC33) R88.2 R106.2 R107.2
5V0_DBG: C59.2 IC14.19(VCC) IC16.1(VIN) IC16.3(EN) L7.2
5V0_SYS: C55.2 C62.2 IC15.1(IN) IC17.30(VDD5) Q1.2(S) R76.2 R79.2 R80.2 R82.1 R89.1 R90.1 R105.2 R108.2
GND: C54.2 C55.1 C56.1 C57.1 C58.1 C59.1 C60.1 C61.1 C62.1 C63.1 C68.1 D9.3(GND) D10.3(GND) D11.3(GND) D11.8(GND) D12.3(GND) D12.8(GND) D13.3(GND) D14.3(GND) IC14.4(GND) IC14.17(GND) IC14.20(GND) IC14.24(AGND) IC14.26(TEST) IC15.2(GND) IC16.2(GND) IC17.13(GND) IC17.28(GND) IC17.31(GND) J7.5(GND) J8.A1(GND) J8.A12(GND) J8.B1(GND) J8.B12(GND) J8.Shell(Shield) J9.5(GND) L9.2 Q2.2(S) R83.1 R84.1 R91.1 R92.1 R110.1
SHIELD: J7.S(SHIELD)
SHIELD_OTG: J9.S(SHIELD) L9.1
USBC_VBUS: C63.2 J8.A4(VBUS) J8.A9(VBUS) J8.B4(VBUS) J8.B9(VBUS) L8.2 R76.1 R86.2
C_CC1: D10.1(IO1) J8.A5(CC1) R95.2 R98.2
C_CC2: D10.2(IO2) J8.B5(CC2) R101.1 R102.1
C_USBSS_RX1_N: D11.1(CH1) J8.B10(SSRXn1) R94.2
C_USBSS_RX1_P: D11.2(CH2) J8.B11(SSRXp1) R97.2
C_USBSS_RX2_N: D12.5(CH4) J8.A10(SSRXn2) R103.2
C_USBSS_RX2_P: D12.4(CH3) J8.A11(SSRXp2) R104.2
C_USBSS_RX6_N: IC17.10(RXn) R100.2
C_USBSS_RX6_P: IC17.9(RXp) R99.2
C_USBSS_TX1_N: C64.1 D11.5(CH4) J8.A3(SSTXn1)
C_USBSS_TX1_P: C65.1 D11.4(CH3) J8.A2(SSTXp1)
C_USBSS_TX2_N: C66.1 D12.2(CH2) J8.B3(SSTXn2)
C_USBSS_TX2_P: C67.1 D12.1(CH1) J8.B2(SSTXp2)
C_USBSS_TX6_N: IC17.7(TXn) R96.2
C_USBSS_TX6_P: IC17.6(TXp) R93.2
CC1: IC17.2(CC1) R95.1 R102.2
CC2: IC17.1(CC2) R98.1 R101.2
DBG_USB_D_N: C57.2 D9.1(IO1) IC14.15(USBDN) J7.2(D-)
DBG_USB_D_P: C56.2 D9.2(IO2) IC14.14(USBDP) J7.3(D+)
EN_MUX: IC17.12(ENn_MUX) R87.1 R91.2
OTG_USB_D_N: D14.1(IO1) J9.2(D-)
OTG_USB_D_P: D14.2(IO2) J9.3(D+)
OTG_USB_VBUS: Q2.3(D)
UART1_RX: R77.2
UART1_TX: R78.2
USB1_D_N: J8.A7(Dn1) J8.B7(Dn2)
USB1_D_P: J8.A6(Dp1) J8.B6(Dp2)
USBC_ADDR: IC17.22(ADDR) TP40.1
USBC_FAULT: IC17.24(VCONN_FAULT_N) TP38.1
USBC_ID: IC17.27(ID) Q1.1(G) R82.2 R87.2 TP37.1
USBC_INTN: IC17.23(INT_N/OUT3) R105.1
USBC_SCL: IC17.26(SCL/OUT2) R107.1
USBC_SDA: IC17.25(SDA/OUT1) R106.1
USBSS_RX1_N: IC17.14(RX1n) R94.1
USBSS_RX1_P: IC17.15(RX1p) R97.1
USBSS_RX2_N: IC17.18(RX2n) R103.1
USBSS_RX2_P: IC17.19(RX2p) R104.1
USBSS_RX6_N: R100.1
USBSS_RX6_P: R99.1
USBSS_TX1_N: C64.2 IC17.16(TX1n)
USBSS_TX1_P: C65.2 IC17.17(TX1p)
USBSS_TX2_N: C66.2 IC17.20(TX2n)
USBSS_TX2_P: C67.2 IC17.21(TX2p)
USBSS_TX6_N: R96.1
USBSS_TX6_P: R93.1
NetC54_1: C54.1 IC15.6(OUT) L8.1
NetC58_2: C58.2 IC14.16(3V3OUT)
NetC60_2: C60.2 IC16.5(VOUT) R85.1
NetC68_2: C68.2 D13.1(IO1) D13.2(IO2) J9.1(VCC) R108.1 R109.1
NetIC14_2: IC14.2(RXD) R78.1
NetIC14_30: IC14.30(TXD) R77.1
NetIC15_3: IC15.3(EN) R80.1 R81.2 R83.2
NetIC15_4: IC15.4(~{FLAG}) LED1.K
NetIC15_5: IC15.5(ILIM) R84.2
NetIC17_3: IC17.3(CURRENT_MODE) R89.2
NetIC17_4: IC17.4(PORT) R90.2
NetIC17_5: IC17.5(VBUS_DET) R86.1
NetIC17_11: IC17.11(DIR) R88.1
NetIC17_29: IC17.29(ENn_CC) R92.2
NetJ7_1: J7.1(VCC) L7.1
NetJ8_B8: J8.B8(SBU2) TP39.1
NetJ9_4: J9.4(ID) TP41.1
NetLED1_A: LED1.A R79.1
NetQ1_3: Q1.3(D) R81.1
NetQ2_1: Q2.1(G) R109.2 R110.2

Not connected (* = marked no-connect by the designer): IC14 3(RI#)* 6(DSR#)* 7(DCD#)* 8(CTS#)* 9(CBUS4)* 10(CBUS2)* 11(CBUS3)* 18(RESET#)* 21(CBUS1)* 22(CBUS0)* 27(OSCI)* 28(OSCO)* 31(DTR#)* 32(RTS#)*; J7 4(ID)*; J8 A8(SBU1)

### Layout directives
differential pair: C_USBSS_RX1_N, C_USBSS_RX1_P, C_USBSS_RX2_N, C_USBSS_RX2_P, C_USBSS_RX6_N, C_USBSS_RX6_P, C_USBSS_TX1_N, C_USBSS_TX1_P, C_USBSS_TX2_N, C_USBSS_TX2_P, C_USBSS_TX6_N, C_USBSS_TX6_P, DBG_USB_D_N, DBG_USB_D_P, OTG_USB_D_N, OTG_USB_D_P, USBSS_RX1_N, USBSS_RX1_P, USBSS_RX2_N, USBSS_RX2_P, USBSS_RX6_N, USBSS_RX6_P, USBSS_TX1_N, USBSS_TX1_P, USBSS_TX2_N, USBSS_TX2_P, USBSS_TX6_N, USBSS_TX6_P
net class Z_90: C_USBSS_RX1_N, C_USBSS_RX1_P, C_USBSS_RX2_N, C_USBSS_RX2_P, C_USBSS_RX6_N, C_USBSS_RX6_P, C_USBSS_TX1_N, C_USBSS_TX1_P, C_USBSS_TX2_N, C_USBSS_TX2_P, C_USBSS_TX6_N, C_USBSS_TX6_P, DBG_USB_D_N, DBG_USB_D_P, OTG_USB_D_N, OTG_USB_D_P, USBSS_RX1_N, USBSS_RX1_P, USBSS_RX2_N, USBSS_RX2_P, USBSS_RX6_N, USBSS_RX6_P, USBSS_TX1_N, USBSS_TX1_P, USBSS_TX2_N, USBSS_TX2_P, USBSS_TX6_N, USBSS_TX6_P

### Notes on the sheet
- USB Load Switch
- Debug UART
- (near L7) Debug USB connector
- (near R76) DNP
- (near LED1) USB_PW
- (near R80) DNP
- (near R84) Current limit set to 2.1A
- USB-C Multiplexer
- (near R87) DNP
- USB-C Connector
- (near R89) DNP
- (near R98) DNP
- (near R102) DNP
- USB-OTG
- Title:
- Size:
- Date:
- A3
- Revision:
- Page:
- of
- Antmicro Ltd.
- File:
- www.antmicro.com
- (in symbol WE_632723300011) USB 3.1 Type C

### Library data of the parts
C54 = C_100u_1210: MLCC SMT Capacitor 100uF 1210; Manufacturer: SAMSUNG; PartSymbol: CL32A107MQVNNNE; Value: 100u; PartNumber: C_100u_1210
C55 = C_1u_0603: as C43 on sheet supply; Value: 1u; PartNumber: C_1u_0603
C56 C57 = C_47p_0603: MLCC SMT Capacitor 47pF 0603; Manufacturer: AVX; PartSymbol: 06031A470KAT2A; Value: 47p; PartNumber: C_47p_0603
C58 C61 = C_100n_0603: as C26 on sheet display; Value: 100n; PartNumber: C_100n_0603
C59 = C_2u2_0402: as C51 on sheet supply; Value: 2u2; PartNumber: C_2u2_0402
C60 = C_1u_0402: as C50 on sheet supply; Value: 1u; PartNumber: C_1u_0402
C62 = C_47u_0805: as C40 on sheet supply; PartNumber: C_47u_0805; Value: 47u
C63 = C_10u_0603: as C49 on sheet supply; PartNumber: C_10u_0603; Value: 10u
C64-C67 = C_100n_0402: as C3 on sheet csi; Value: 100n; PartNumber: C_100n_0402
C68 = C_4u7_0603: as C48 on sheet supply; PartNumber: C_4u7_0603; Value: 4u7
D9 = TPD2E009: ESD Suppressors 2-CH; Manufacturer: Texas Instruments; Value: TPD2E009DRTR; PartNumber: TPD2E009DRTR; PartSymbol: TPD2E009DRTR
D10 D13 D14 = TPD2E009: ESD Suppressors 2-CH; PartNumber: TPD2E009DRTR; Value: TPD2E009DRTR; PartSymbol: TPD2E009DRTR
D11 D12 = TPD4E05U06: ESD Suppressors 4-CH; PartNumber: TPD4E05U06_PASS; Value: TPD4E05U06
IC14 = FT232RQ: USB to serial UART interface; PartSymbol: FT232RQ-REEL; Value: FT232RQ; PartNumber: FT232RQ
IC15 = NCP380HSNAJAAT1G: POWER LOAD SWITCH, HIGH SIDE; Value: NCP380HSNAJAAT1G; PartNumber: NCP380HSNAJAAT1G; PartSymbol: NCP380HSNAJAAT1G
IC16 = TLV700: Voltage Regulator, 2V to 5.5V, 175mV Dropout, 1.8Vout, 200mAout; Value: TLV70018DCKT; PartNumber: TLV70018DCKT; PartSymbol: TLV70018DCKT
IC17 = HD3SS3220: IC DRP PORT CTLR USB-C 30WQFN; PartSymbol: HD3SS3220RNHT; PartNumber: HD3SS3220; Value: HD3SS3220
J7 J9 = Micro USB B: USB - micro B Receptacle Connector 5 Position Surface Mount, Right Angle, Horizontal; PartNumber: CON-Molex-47346-0001; Value: Molex 47346-0001
J8 = WE_632723300011: USB 3.1 Type C Receptacle Horizontal THR WR-COM; PartNumber: WE_632723300011; Value: 632723300011; PartSymbol: 632723300011
L7 = 742792022: MURATA  BLM18EG221SN1D  FERRITE BEAD, 0.05OHM, 2A, 0603; Manufacturer: WURTH ELEKTRONIK; Value: 742792022; PartNumber: 742792022; PartSymbol: 742792022
L8 = BLM18EG221SN1D: MURATA  BLM18EG221SN1D  FERRITE BEAD, 0.05OHM, 2A, 0603; Value: BLM18EG221SN1D; Manufacturer: MURATA; PartNumber: BLM18EG221SN1D; PartSymbol: BLM18EG221SN1D
L9 = BLM18SG121TN1D: FERRITE BEAD, 0.025OHM, 3A, 0603; Value: BLM18SG121TN1D; PartNumber: BLM18SG121TN1D; PartSymbol: BLM18SG121TN1D
LED1 = LED: LED Green 0603 case; Manufacturer: KINGBRIGHT; PartNumber: LED_G; Value: KPT-1608SGC; PartSymbol: KPT-1608SGC
Q1 = PMOS: P CH, 20V, 4A; Manufacturer: NXP; PartNumber: PMV32UP; Value: PMV32UP; PartSymbol: PMV32UP
Q2 = NMOS_PMV16XN: MOSFET, N CH; Manufacturer: NXP; Value: PMV16XN; PartNumber: PMV16XN; PartSymbol: PMV16XN
R76 R85 = R_0R_0603: RES, 0R, 0603; Manufacturer: BOURNS; PartSymbol: CR0603-J/-000ELF; Value: 0R; PartNumber: R_0R_0603
R77 R78 = R_22R_0402: RES, 22R, 0402; Manufacturer: VISHAY; PartSymbol: CRCW040222R0FKED; Value: 22R; PartNumber: R_22R_0402
R79 = R_470R_0603: RES, 470R, 0603; Manufacturer: BOURNS; PartSymbol: CR0603-JW-471GLF; Tolerance: 0.1%; Value: 10k2; PartNumber: R_470R_0603
R80 R81 R87 R91-R104 R108 = R_0R_0402: as R1 on sheet csi; PartNumber: R_0R_0402; Value: 0R
R82 = R_100k_0603: as R36 on sheet display; Value: 100k; PartNumber: R_100k_0603
R83 R89 R109 R110 = R_10k_0402: as R35 on sheet display; Value: 10k; PartNumber: R_10k_0402
R84 = R_5k6_0603: RES, 5k6, 0603; Manufacturer: Panasonic; PartSymbol: ERJ3GEYJ562V; PartNumber: R_5k6_0603; Value: 10k2
R86 = R_909k_0402: RES, 909k, 0402; Manufacturer: Panasonic; PartSymbol: ERJ2RKF9093X; PartNumber: R_909k_0402; Value: 909k
R88 R105 = R_200k_0402: as R66 on sheet supply; PartNumber: R_200k_0402; Value: 200k
R90 = R_4k7_0402: RES, 4k7, 0402; Manufacturer: Panasonic; PartSymbol: ERJ2GEJ472X; PartNumber: R_4k7_0402; Value: 4k7
R106 R107 = R_2k2_0402: RES, 2k2, 0402; Manufacturer: MULTICOMP; PartSymbol: MCWR04X2201FTL; PartNumber: R_2k2_0402; Value: 2k2
TP37-TP41 = Testpad: Testpad, round, 1.5mm; PartNumber: TP-R-1.5